# EAGLE schematic PDNode-600 Pro (EAGLE 9.2.1), part 1 of 2

## Sheet 1 of 12
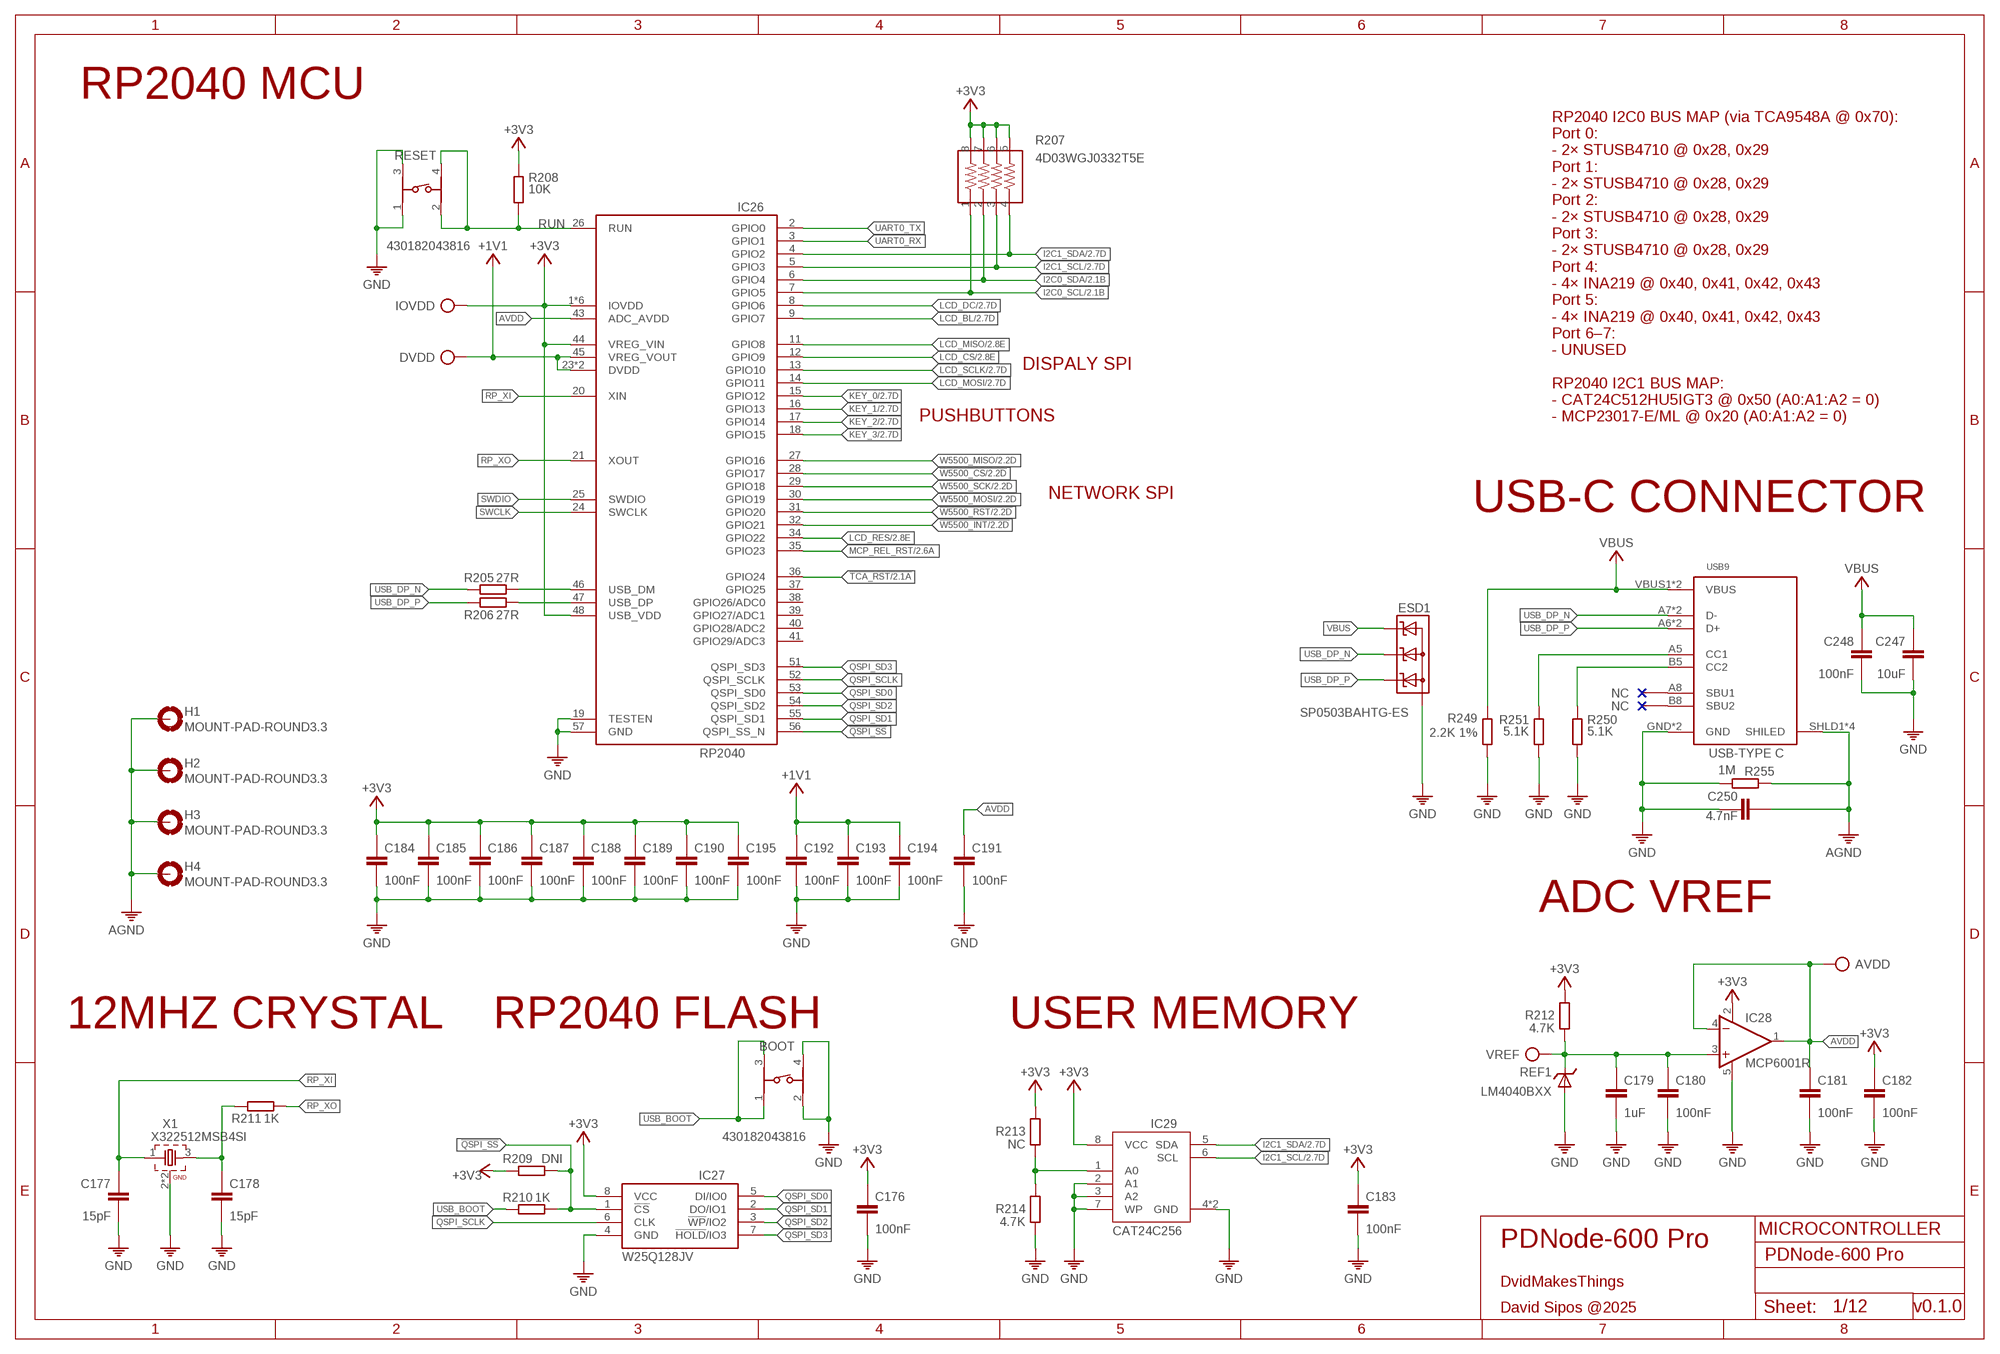
[diagram p0: schematic, sheet 1]

### Parts
AVDD  TP  [TP]
BOOT  430182043816  430182050816  [430182050816]
C176  100nF  C-0201  [0201]
C177  15pF  C-0201  [0201]
C178  15pF  C-0201  [0201]
C179  1uF  C-0402  [C0402]
C180  100nF  C-0201  [0201]
C181  100nF  C-0201  [0201]
C182  100nF  C-0201  [0201]
C183  100nF  C-0201  [0201]
C184  100nF  C-0201  [0201]
C185  100nF  C-0201  [0201]
C186  100nF  C-0201  [0201]
C187  100nF  C-0201  [0201]
C188  100nF  C-0201  [0201]
C189  100nF  C-0201  [0201]
C190  100nF  C-0201  [0201]
C191  100nF  C-0201  [0201]
C192  100nF  C-0201  [0201]
C193  100nF  C-0201  [0201]
C194  100nF  C-0201  [0201]
C195  100nF  C-0201  [0201]
C247  10uF  C0805  [0805]
C248  100nF  C0402  [0402]
C250  4.7nF  C-0402  [C0402]
DVDD  TP  [TP]
ESD1  SP0503BAHTG-ES  SP0503BAHT  [SOT143]
H1  MOUNT-PAD-ROUND3.3  [3,3-PAD]
H2  MOUNT-PAD-ROUND3.3  [3,3-PAD]
H3  MOUNT-PAD-ROUND3.3  [3,3-PAD]
H4  MOUNT-PAD-ROUND3.3  [3,3-PAD]
IC26  RP2040  [QFN40P700X700X100-57T510]
IC27  W25Q128JVPIQ  W25Q128JVP  [SON127P600X500X75-8N]
IC28  MCP6001R  MCP6001RT  [SOT23-5]
IC29  CAT24C512HU5IGT3  CAT24C256-HU4  [SON50P300X200X50-9T130X140N]
IOVDD  TP  [TP]
R205  27R  R0201  [R0201]
R206  27R  R0201  [R0201]
R207  4D03WGJ0332T5E  742C083103JP  [742C083103JP]
R208  10K  R0201  [R0201]
R209  DNI  R0201  [R0201]
R210  1K  R0201  [R0201]
R211  1K  R0201  [R0201]
R212  4.7K  R0402  [0402]
R213  NC  R0201  [R0201]
R214  4.7K  R0201  [R0201]
R249  2.2K 1%  R0201  [R0201]
R250  5.1K  R0201  [R0201]
R251  5.1K  R0201  [R0201]
R255  1M  R0402  [0402]
REF1  LM4040BXX  [SOT23]
RESET  430182043816  430182050816  [430182050816]
USB9  USB_C-THT  [USB-C]
VREF  TP  [TP]
X1  X322512MSB4SI  WE-XTAL_CFPX-180_830055295  [WE-XTAL_CFPX-180]

### Nets
!QSPI_SS: IC26.56(QSPI_SS_N) IC27.1(!CS) R209.1 R210.2
!TCA_RST: IC26.36(GPIO24) ; also sheet 2
!W5500_CS: IC26.28(GPIO17) ; also sheet 2
!W5500_INT: IC26.32(GPIO21) ; also sheet 2
!W5500_RST: IC26.31(GPIO20) ; also sheet 2
+1V1: C192.1 C193.1 C194.1 DVDD.TP IC26.23(DVDD) IC26.45(VREG_VOUT) IC26.50(DVDD)
+3V3: C176.1 C182.1 C183.1 C184.1 C185.1 C186.1 C187.1 C188.1 C189.1 C190.1 C195.1 IC26.1(IOVDD) IC26.10(IOVDD) IC26.22(IOVDD) IC26.33(IOVDD) IC26.42(IOVDD) IC26.44(VREG_VIN) IC26.48(USB_VDD) IC26.49(IOVDD) IC27.8(VCC) IC28.2(V+) IC29.8(VCC) IOVDD.TP R207.5 R207.6 R207.7 R207.8 R208.1 R209.2 R212.2 R213.2 ; also sheet 2,3,4,5,6,7,8,9,10,11,12
AGND: C250.1 H1.B3,3(MOUNT) H2.B3,3(MOUNT) H3.B3,3(MOUNT) H4.B3,3(MOUNT) R255.1 USB9.SHLD1(SHILED) USB9.SHLD2(SHILED) USB9.SHLD3(SHILED) USB9.SHLD4(SHILED) ; also sheet 2,4,5,6,7,8,9,10,11,12
AVDD: AVDD.TP C181.1 C191.1 IC26.43(ADC_AVDD) IC28.1(OUT) IC28.4(-IN)
CC1: R251.1 USB9.A5(CC1)
CC2: R250.1 USB9.B5(CC2)
GND: BOOT.2 BOOT.4 C176.2 C177.2 C178.2 C179.2 C180.2 C181.2 C182.2 C183.2 C184.2 C185.2 C186.2 C187.2 C188.2 C189.2 C190.2 C191.2 C192.2 C193.2 C194.2 C195.2 C247.2 C248.2 C250.2 ESD1.1(A) IC26.19(TESTEN) IC26.57(GND) IC27.4(GND) IC28.5(V-) IC29.2(A1) IC29.3(A2) IC29.4(GND) IC29.7(WP) IC29.9(GND) R214.1 R249.2 R250.2 R251.2 R255.2 REF1.2(A) REF1.3(A) RESET.1 RESET.3 USB9.GND USB9.GND2(GND) X1.2(GND) X1.4(GND) ; also sheet 2,3,4,5,6,7,8,9,10,11,12
I2C0_SCL: IC26.7(GPIO5) R207.1 ; also sheet 2
I2C0_SDA: IC26.6(GPIO4) R207.2 ; also sheet 2
I2C1_SCL: IC26.5(GPIO3) IC29.6(SCL) R207.3 ; also sheet 2
I2C1_SDA: IC26.4(GPIO2) IC29.5(SDA) R207.4 ; also sheet 2
KEY_0: IC26.15(GPIO12) ; also sheet 2
KEY_1: IC26.16(GPIO13) ; also sheet 2
KEY_2: IC26.17(GPIO14) ; also sheet 2
KEY_3: IC26.18(GPIO15) ; also sheet 2
LCD_BL: IC26.9(GPIO7) ; also sheet 2
LCD_CS: IC26.12(GPIO9) ; also sheet 2
LCD_DC: IC26.8(GPIO6) ; also sheet 2
LCD_MISO: IC26.11(GPIO8) ; also sheet 2
LCD_MOSI: IC26.14(GPIO11) ; also sheet 2
LCD_RES: IC26.34(GPIO22) ; also sheet 2
LCD_SCLK: IC26.13(GPIO10) ; also sheet 2
MCP_REL_RST: IC26.35(GPIO23) ; also sheet 2
MCU_DP_N [90R_DIFFPAIR]: IC26.46(USB_DM) R205.2
MCU_DP_P [90R_DIFFPAIR]: IC26.47(USB_DP) R206.2
N$43: C178.1 R211.1 X1.3
N$222: IC29.1(A0) R213.1 R214.2
QSPI_SCLK: IC26.52(QSPI_SCLK) IC27.6(CLK)
QSPI_SD0: IC26.53(QSPI_SD0) IC27.5(DI/IO0)
QSPI_SD1: IC26.55(QSPI_SD1) IC27.2(DO/IO1)
QSPI_SD2: IC26.54(QSPI_SD2) IC27.3(!WP!/IO2)
QSPI_SD3: IC26.51(QSPI_SD3) IC27.7(!HOLD!/IO3)
RP_XI: C177.1 IC26.20(XIN) X1.1
RP_XO: IC26.21(XOUT) R211.2
RUN: IC26.26(RUN) R208.2 RESET.2 RESET.4
SWCLK: IC26.24(SWCLK)
SWDIO: IC26.25(SWDIO)
UART0_RX: IC26.3(GPIO1)
UART0_TX: IC26.2(GPIO0)
USB_BOOT: BOOT.1 BOOT.3 R210.1
USB_DP_N [90R_DIFFPAIR]: ESD1.3(C2) R205.1 USB9.A7(D-) USB9.B7(D-)
USB_DP_P [90R_DIFFPAIR]: ESD1.2(C1) R206.1 USB9.A6(D+) USB9.B6(D+)
VBUS: C247.1 C248.1 ESD1.4(C3) R249.1 USB9.VBUS1(VBUS) USB9.VBUS2(VBUS)
VREF: C179.1 C180.1 IC28.3(+IN) R212.1 REF1.1(C) VREF.TP
W5500_MISO: IC26.27(GPIO16) ; also sheet 2
W5500_MOSI: IC26.30(GPIO19) ; also sheet 2
W5500_SCK: IC26.29(GPIO18) ; also sheet 2
Unconnected: IC26.37(GPIO25) IC26.38(GPIO26/ADC0) IC26.39(GPIO27/ADC1) IC26.40(GPIO28/ADC2) IC26.41(GPIO29/ADC3) USB9.A8(SBU1) USB9.B8(SBU2)

### Notes on the sheet
- RP2040 MCU
- DISPALY SPI
- PUSHBUTTONS
- RP2040 I2C0 BUS MAP (via TCA9548A @ 0x70):
  Port 0:
  - 2× STUSB4710 @ 0x28, 0x29
  Port 1:
  - 2× STUSB4710 @ 0x28, 0x29
  Port 2:
  - 2× STUSB4710 @ 0x28, 0x29
  Port 3:
  - 2× STUSB4710 @ 0x28, 0x29
  Port 4:
  - 4× INA219 @ 0x40, 0x41, 0x42, 0x43
  Port 5:
  - 4× INA219 @ 0x40, 0x41, 0x42, 0x43
  Port 6–7:
  - UNUSED
  
  RP2040 I2C1 BUS MAP:
  - CAT24C512HU5IGT3 @ 0x50 (A0:A1:A2 = 0)
  - MCP23017-E/ML @ 0x20 (A0:A1:A2 = 0)
- NETWORK SPI
- USB-C CONNECTOR
- ADC VREF
- 12MHZ CRYSTAL | RP2040 FLASH | USER MEMORY
- MICROCONTROLLER
- PDNode-600 Pro
- DvidMakesThings
- David Sipos @2025 | v0.1.0

## Sheet 2 of 12
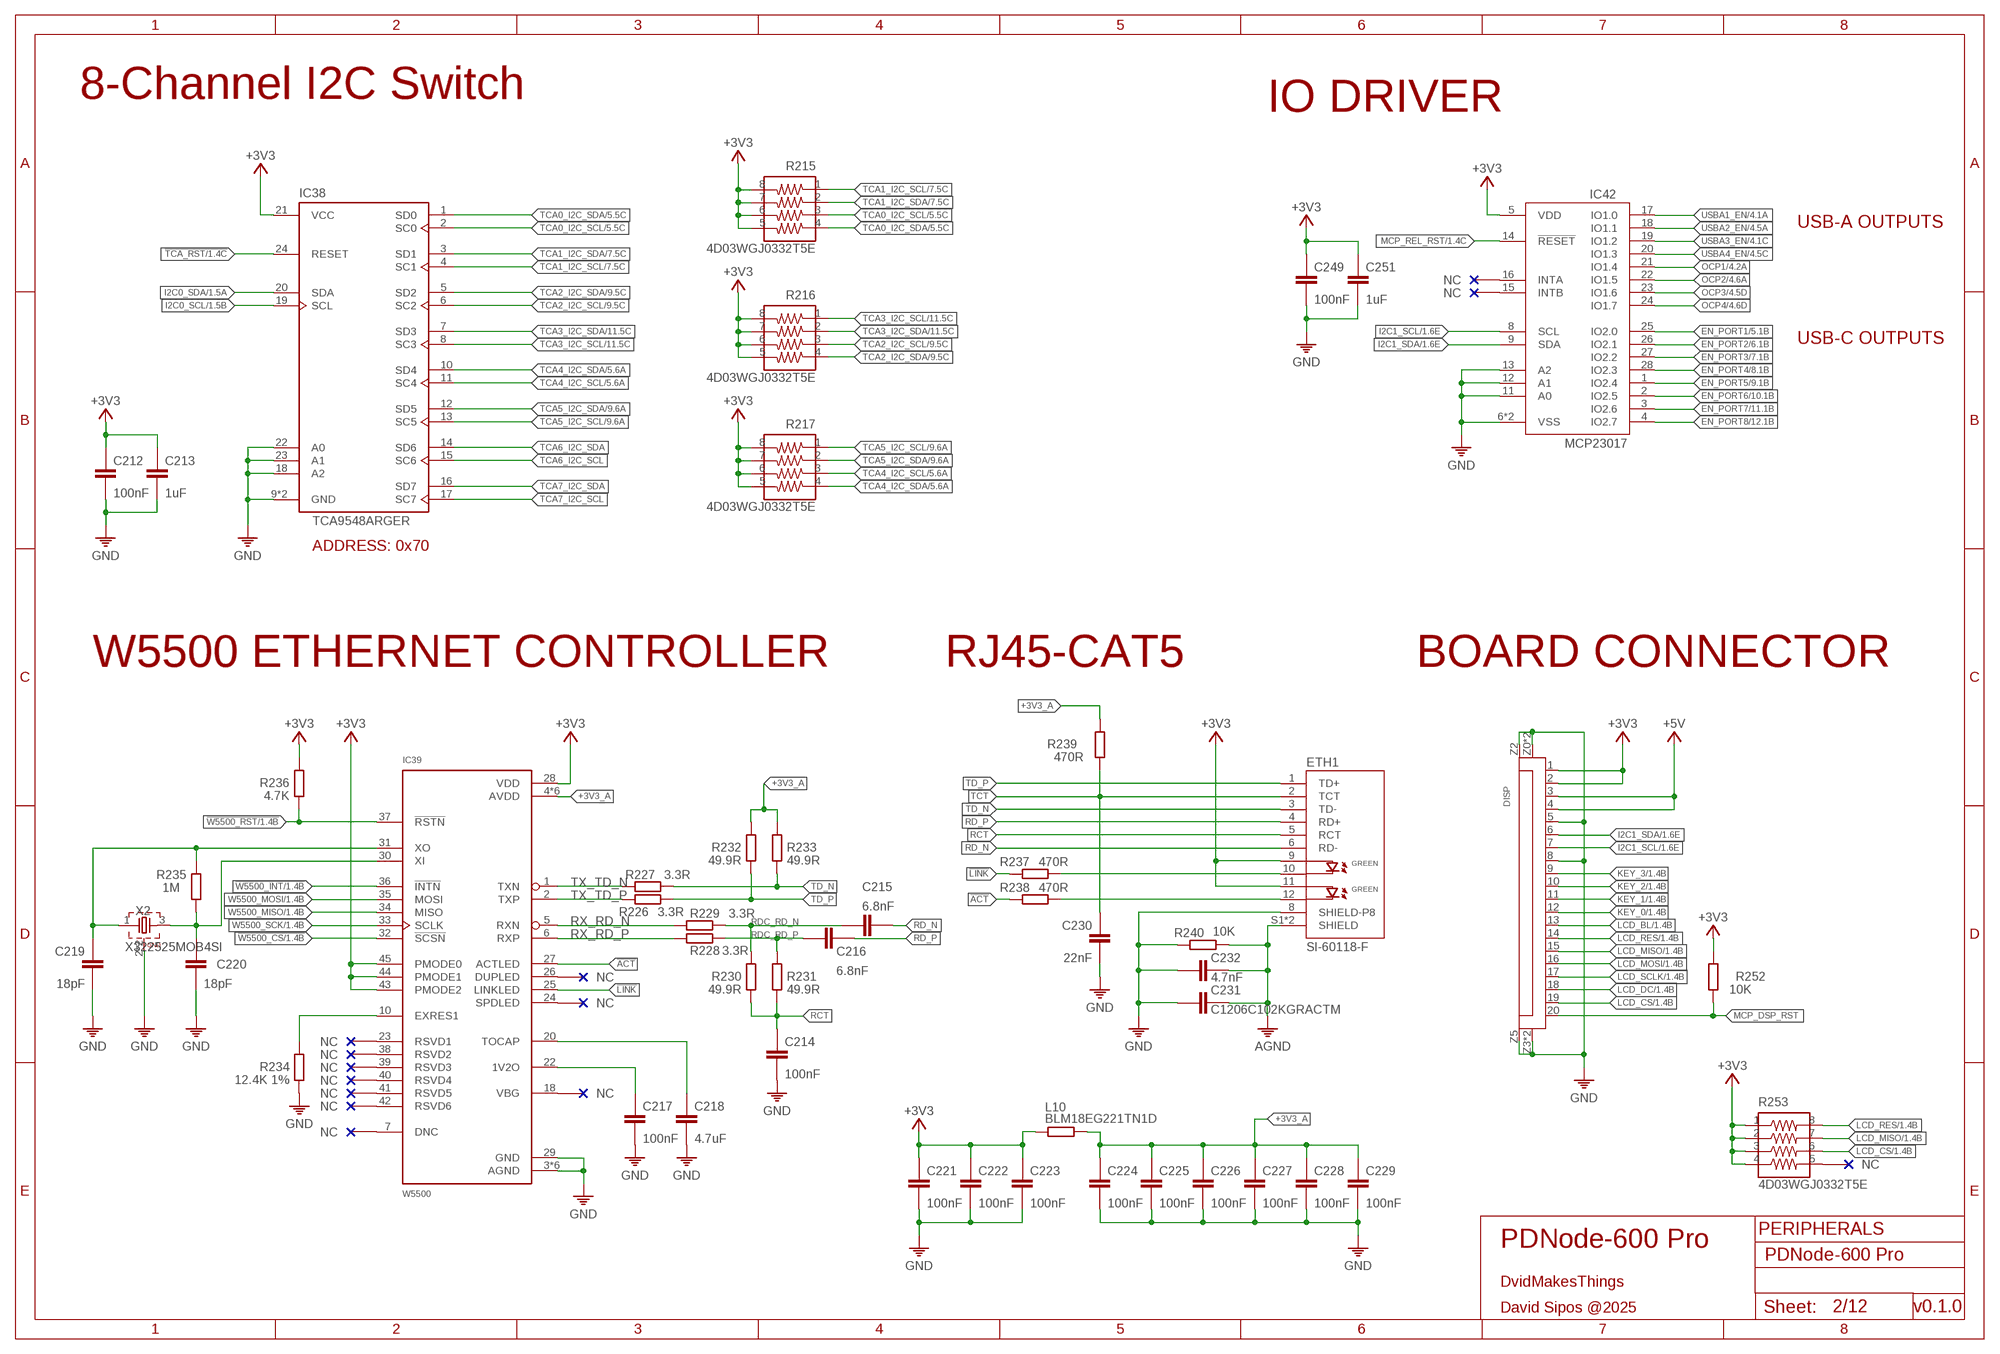
[diagram p1: schematic, sheet 2]

### Parts
C212  100nF  C-0201  [0201]
C213  1uF  C-0201  [0201]
C214  100nF  C-0201  [0201]
C215  6.8nF  C-0201  [0201]
C216  6.8nF  C-0201  [0201]
C217  100nF  C-0201  [0201]
C218  4.7uF  C-0402  [C0402]
C219  18pF  C-0201  [0201]
C220  18pF  C-0201  [0201]
C221  100nF  C-0201  [0201]
C222  100nF  C-0201  [0201]
C223  100nF  C-0201  [0201]
C224  100nF  C-0201  [0201]
C225  100nF  C-0201  [0201]
C226  100nF  C-0201  [0201]
C227  100nF  C-0201  [0201]
C228  100nF  C-0201  [0201]
C229  100nF  C-0201  [0201]
C230  22nF  C-0402  [C0402]
C231  C1206C102KGRACTM  C-1206  [C1206]
C232  4.7nF  C-0402  [C0402]
C249  100nF  C-0201  [0201]
C251  1uF  C-0201  [0201]
DISP  AFC11-S20ICC-00  [FPC20]
ETH1  SI-60118-F  RJ45-CAT5  [RJ45-CAT5]
IC38  TCA9548ARGER  [QFN50P400X400X100-25T210N]
IC39  W5500  [LQFP48]
IC42  MCP23017-E/ML  [QFN28[6X6]ML]
L10  BLM18EG221TN1D  R0603  [0603]
R215  4D03WGJ0332T5E  YC164-JR-0733RL  [YC164-JR-0733RL]
R216  4D03WGJ0332T5E  YC164-JR-0733RL  [YC164-JR-0733RL]
R217  4D03WGJ0332T5E  YC164-JR-0733RL  [YC164-JR-0733RL]
R226  3.3R  R0201  [R0201]
R227  3.3R  R0201  [R0201]
R228  3.3R  R0201  [R0201]
R229  3.3R  R0201  [R0201]
R230  49.9R  R0201  [R0201]
R231  49.9R  R0201  [R0201]
R232  49.9R  R0201  [R0201]
R233  49.9R  R0201  [R0201]
R234  12.4K 1%  R0201  [R0201]
R235  1M  R0201  [R0201]
R236  4.7K  R0201  [R0201]
R237  470R  R0402  [0402]
R238  470R  R0402  [0402]
R239  470R  R0402  [0402]
R240  10K  R0402  [0402]
R252  10K  R0402  [0402]
R253  4D03WGJ0332T5E  742C083103JP  [742C083103JP]
X2  X322525MOB4SI  WE-XTAL_CFPX-180_830035268  [WE-XTAL_CFPX-180]

### Nets
!ACT: IC39.27(ACTLED) R238.1
!LINK: IC39.25(LINKLED) R237.1
!TCA_RST: IC38.24(RESET) ; also sheet 1
!W5500_CS: IC39.32(!SCSN) ; also sheet 1
!W5500_INT: IC39.36(!INTN) ; also sheet 1
!W5500_RST: IC39.37(!RSTN) R236.1 ; also sheet 1
+3V3: C212.1 C213.1 C221.1 C222.1 C223.1 C249.1 C251.1 DISP.1 DISP.2 ETH1.9(GA1) ETH1.11(GA2) IC38.21(VCC) IC39.28(VDD) IC39.43(PMODE2) IC39.44(PMODE1) IC39.45(PMODE0) IC42.5(VDD) L10.1 R215.5 R215.6 R215.7 R215.8 R216.5 R216.6 R216.7 R216.8 R217.5 R217.6 R217.7 R217.8 R236.2 R252.2 R253.1 R253.2 R253.3 R253.4 ; also sheet 1,3,4,5,6,7,8,9,10,11,12
+3V3_A: C224.1 C225.1 C226.1 C227.1 C228.1 C229.1 IC39.4(AVDD) IC39.8(AVDD) IC39.11(AVDD) IC39.15(AVDD) IC39.17(AVDD) IC39.21(AVDD) L10.2 R232.2 R233.2 R239.2
+5V: DISP.3 DISP.4
AGND: C231.2 C232.2 ETH1.S1(SHIELD) ETH1.S2(SHIELD) R240.2 ; also sheet 1,4,5,6,7,8,9,10,11,12
EN_PORT1: IC42.25(IO2.0) ; also sheet 5
EN_PORT2: IC42.26(IO2.1) ; also sheet 6
EN_PORT3: IC42.27(IO2.2) ; also sheet 7
EN_PORT4: IC42.28(IO2.3) ; also sheet 8
EN_PORT5: IC42.1(IO2.4) ; also sheet 9
EN_PORT6: IC42.2(IO2.5) ; also sheet 10
EN_PORT7: IC42.3(IO2.6) ; also sheet 11
EN_PORT8: IC42.4(IO2.7) ; also sheet 12
GND: C212.2 C213.2 C214.2 C217.2 C218.2 C219.2 C220.2 C221.2 C222.2 C223.2 C224.2 C225.2 C226.2 C227.2 C228.2 C229.2 C230.2 C231.1 C232.1 C249.2 C251.2 DISP.5 DISP.8 DISP.Z0(Z1) DISP.Z1 DISP.Z2 DISP.Z3 DISP.Z4(Z3) DISP.Z5(Z4) ETH1.8(SHIELD-P8) IC38.9(GND) IC38.18(A2) IC38.22(A0) IC38.23(A1) IC38.25(GND) IC39.3(AGND) IC39.9(AGND) IC39.14(AGND) IC39.16(AGND) IC39.19(AGND) IC39.29(GND) IC39.48(AGND) IC42.6(VSS) IC42.11(A0) IC42.12(A1) IC42.13(A2) IC42.PAD(VSS) R234.1 R240.1 X2.2(GND) X2.4(GND) ; also sheet 1,3,4,5,6,7,8,9,10,11,12
I2C0_SCL: IC38.19(SCL) ; also sheet 1
I2C0_SDA: IC38.20(SDA) ; also sheet 1
I2C1_SCL: DISP.7 IC42.8(SCL) ; also sheet 1
I2C1_SDA: DISP.6 IC42.9(SDA) ; also sheet 1
KEY_0: DISP.12 ; also sheet 1
KEY_1: DISP.11 ; also sheet 1
KEY_2: DISP.10 ; also sheet 1
KEY_3: DISP.9 ; also sheet 1
LCD_BL: DISP.13 ; also sheet 1
LCD_CS: DISP.19 R253.6 ; also sheet 1
LCD_DC: DISP.18 ; also sheet 1
LCD_MISO: DISP.15 R253.7 ; also sheet 1
LCD_MOSI: DISP.16 ; also sheet 1
LCD_RES: DISP.14 R253.8 ; also sheet 1
LCD_SCLK: DISP.17 ; also sheet 1
MCP_DSP_RST: DISP.20 R252.1
MCP_REL_RST: IC42.14(!RESET) ; also sheet 1
N$252: IC39.10(EXRES1) R234.2
N$257: C217.1 IC39.22(1V2O)
N$258: C218.1 IC39.20(TOCAP)
N$259: C220.1 IC39.30(XI) R235.1 X2.3
N$260: ETH1.10(GK1) R237.2
N$261: ETH1.12(GK2) R238.2
OCP1: IC42.21(IO1.4) ; also sheet 4
OCP2: IC42.22(IO1.5) ; also sheet 4
OCP3: IC42.23(IO1.6) ; also sheet 4
OCP4: IC42.24(IO1.7) ; also sheet 4
RCT: C214.1 ETH1.5(RCT) R230.1 R231.1
RD_N [100R_DIFFPAIR]: C215.2 ETH1.6(RD-)
RD_P [100R_DIFFPAIR]: C216.2 ETH1.4(RD+)
RDC_RD_N [100R_DIFFPAIR]: C215.1 R229.2 R230.2
RDC_RD_P [100R_DIFFPAIR]: C216.1 R228.2 R231.2
RX_RD_N [100R_DIFFPAIR]: IC39.5(RXN) R229.1
RX_RD_P [100R_DIFFPAIR]: IC39.6(RXP) R228.1
TCA0_I2C_SCL: IC38.2(SC0) R215.3 ; also sheet 5,6
TCA0_I2C_SDA: IC38.1(SD0) R215.4 ; also sheet 5,6
TCA1_I2C_SCL: IC38.4(SC1) R215.1 ; also sheet 7,8
TCA1_I2C_SDA: IC38.3(SD1) R215.2 ; also sheet 7,8
TCA2_I2C_SCL: IC38.6(SC2) R216.3 ; also sheet 9,10
TCA2_I2C_SDA: IC38.5(SD2) R216.4 ; also sheet 9,10
TCA3_I2C_SCL: IC38.8(SC3) R216.1 ; also sheet 11,12
TCA3_I2C_SDA: IC38.7(SD3) R216.2 ; also sheet 11,12
TCA4_I2C_SCL: IC38.11(SC4) R217.3 ; also sheet 5,6,7,8
TCA4_I2C_SDA: IC38.10(SD4) R217.4 ; also sheet 5,6,7,8
TCA5_I2C_SCL: IC38.13(SC5) R217.1 ; also sheet 9,10,11,12
TCA5_I2C_SDA: IC38.12(SD5) R217.2 ; also sheet 9,10,11,12
TCA6_I2C_SCL: IC38.15(SC6)
TCA6_I2C_SDA: IC38.14(SD6)
TCA7_I2C_SCL: IC38.17(SC7)
TCA7_I2C_SDA: IC38.16(SD7)
TCT: C230.1 ETH1.2(TCT) R239.1
TD_N [100R_DIFFPAIR]: ETH1.3(TD-) R227.2 R233.1
TD_P [100R_DIFFPAIR]: ETH1.1(TD+) R226.2 R232.1
TX_TD_N [100R_DIFFPAIR]: IC39.1(TXN) R227.1
TX_TD_P [100R_DIFFPAIR]: IC39.2(TXP) R226.1
USBA1_EN: IC42.17(IO1.0) ; also sheet 4
USBA2_EN: IC42.18(IO1.1) ; also sheet 4
USBA3_EN: IC42.19(IO1.2) ; also sheet 4
USBA4_EN: IC42.20(IO1.3) ; also sheet 4
W5500_MISO: IC39.34(MISO) ; also sheet 1
W5500_MOSI: IC39.35(MOSI) ; also sheet 1
W5500_SCK: IC39.33(SCLK) ; also sheet 1
XO: C219.1 IC39.31(XO) R235.2 X2.1
Unconnected: IC39.7(DNC) IC39.18(VBG) IC39.23(RSVD1) IC39.24(SPDLED) IC39.26(DUPLED) IC39.38(RSVD2) IC39.39(RSVD3) IC39.40(RSVD4) IC39.41(RSVD5) IC39.42(RSVD6) IC42.15(INTB) IC42.16(INTA) R253.5

### Notes on the sheet
- 8-Channel I2C Switch | IO DRIVER
- USB-A OUTPUTS
- USB-C OUTPUTS
- ADDRESS: 0x70
- W5500 ETHERNET CONTROLLER | RJ45-CAT5 | BOARD CONNECTOR
- PERIPHERALS
- PDNode-600 Pro
- DvidMakesThings
- David Sipos @2025 | v0.1.0

## Sheet 3 of 12: POWER
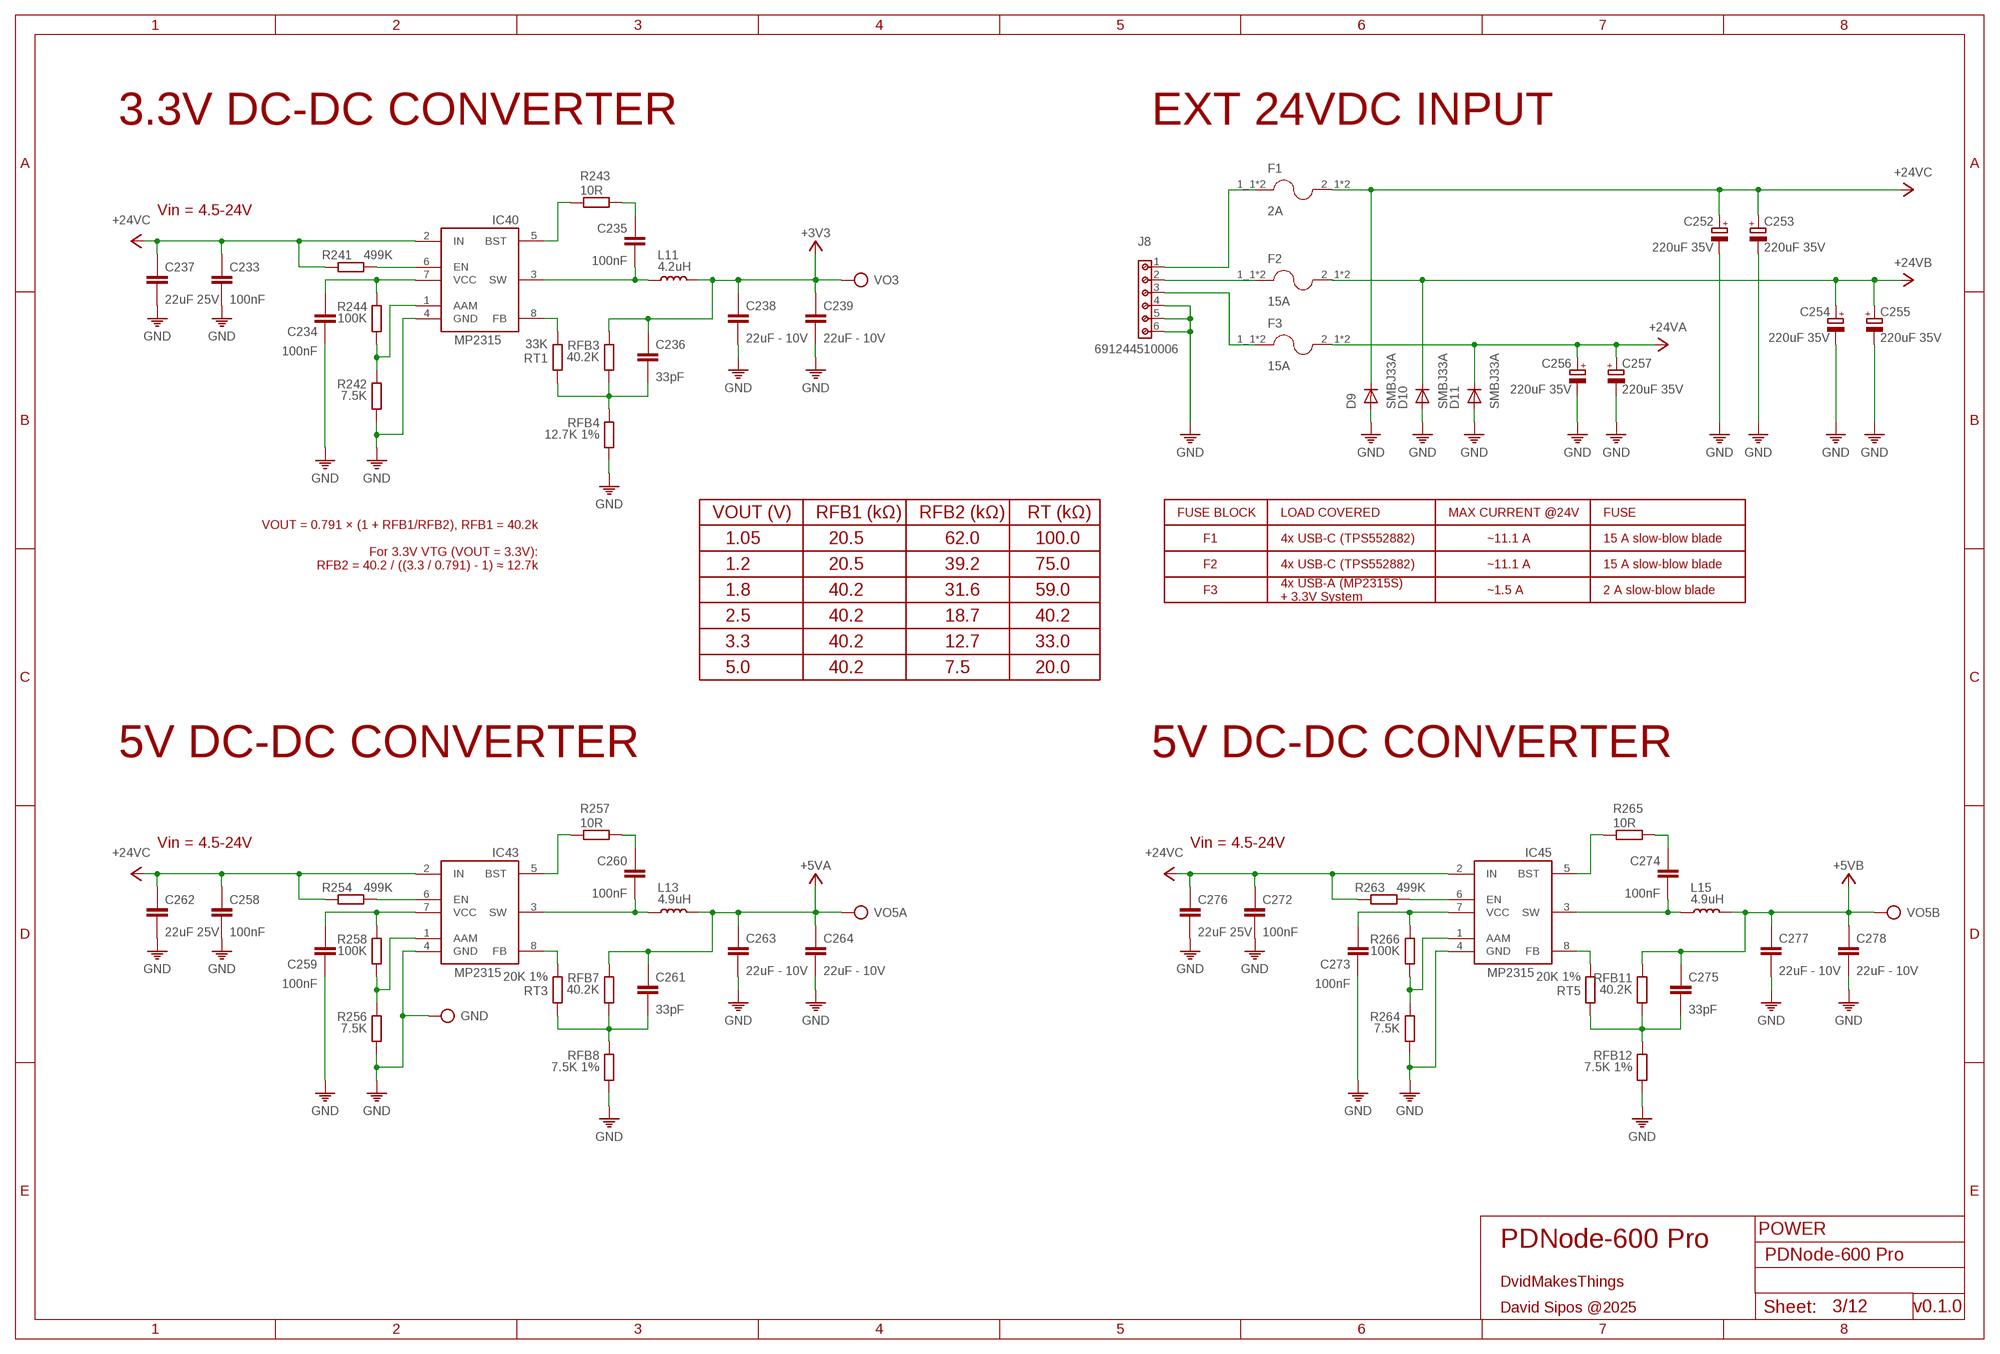
[diagram p2: schematic, sheet 3]

### Parts
C233  100nF  C-0201  [0201]
C234  100nF  C-0201  [0201]
C235  100nF  C-0201  [0201]
C236  33pF  C-0201  [0201]
C237  22uF 25V  C-1206  [C1206]
C238  22uF - 10V  C-1206  [C1206]
C239  22uF - 10V  C-1206  [C1206]
C252  220uF 35V  C-POL_ECAP-8.5MM  [CAPAE830X1050N]
C253  220uF 35V  C-POL_ECAP-8.5MM  [CAPAE830X1050N]
C254  220uF 35V  C-POL_ECAP-8.5MM  [CAPAE830X1050N]
C255  220uF 35V  C-POL_ECAP-8.5MM  [CAPAE830X1050N]
C256  220uF 35V  C-POL_ECAP-8.5MM  [CAPAE830X1050N]
C257  220uF 35V  C-POL_ECAP-8.5MM  [CAPAE830X1050N]
C258  100nF  C-0201  [0201]
C259  100nF  C-0201  [0201]
C260  100nF  C-0201  [0201]
C261  33pF  C-0201  [0201]
C262  22uF 25V  C-1206  [C1206]
C263  22uF - 10V  C-1206  [C1206]
C264  22uF - 10V  C-1206  [C1206]
C272  100nF  C-0201  [0201]
C273  100nF  C-0201  [0201]
C274  100nF  C-0201  [0201]
C275  33pF  C-0201  [0201]
C276  22uF 25V  C-1206  [C1206]
C277  22uF - 10V  C-1206  [C1206]
C278  22uF - 10V  C-1206  [C1206]
D9  SMBJ33A  DIODE-SMB  [SMB]
D10  SMBJ33A  DIODE-SMB  [SMB]
D11  SMBJ33A  DIODE-SMB  [SMB]
F1  2A  BLADE-FUSE  [FUSE_3544-2]
F2  15A  BLADE-FUSE  [FUSE_3544-2]
F3  15A  BLADE-FUSE  [FUSE_3544-2]
GND  TP  [TP]
IC40  MP2315S  MP2315TSOT23-8  [SOT65P280X110-8N]
IC43  MP2315S  MP2315TSOT23-8  [SOT65P280X110-8N]
IC45  MP2315S  MP2315TSOT23-8  [SOT65P280X110-8N]
J8  691244510006  [691244510006]
L11  4.2uH  L  [SRR5228A]
L13  4.9uH  L  [SRR5228A]
L15  4.9uH  L  [SRR5228A]
R241  499K  R0201  [R0201]
R242  7.5K  R0201  [R0201]
R243  10R  R0201  [R0201]
R244  100K  R0201  [R0201]
R254  499K  R0201  [R0201]
R256  7.5K  R0201  [R0201]
R257  10R  R0201  [R0201]
R258  100K  R0201  [R0201]
R263  499K  R0201  [R0201]
R264  7.5K  R0201  [R0201]
R265  10R  R0201  [R0201]
R266  100K  R0201  [R0201]
RFB3  40.2K  R0201  [R0201]
RFB4  12.7K 1%  R0201  [R0201]
RFB7  40.2K  R0201  [R0201]
RFB8  7.5K 1%  R0201  [R0201]
RFB11  40.2K  R0201  [R0201]
RFB12  7.5K 1%  R0201  [R0201]
RT1  33K  R0201  [R0201]
RT3  20K 1%  R0201  [R0201]
RT5  20K 1%  R0201  [R0201]
VO3  TP  [TP]
VO5A  TP  [TP]
VO5B  TP  [TP]

### Nets
3V3_EN_SYS1: IC40.6(EN) R241.2
3V3_EN_SYS3: IC43.6(EN) R254.2
3V3_EN_SYS5: IC45.6(EN) R263.2
24VINA: F2.1_1 F2.1_2 J8.2
24VINB: F3.1_1 F3.1_2 J8.3
24VINC: F1.1_1 F1.1_2 J8.1
+3V3: C236.1 C238.1 C239.1 L11.2 RFB3.1 VO3.TP ; also sheet 1,2,4,5,6,7,8,9,10,11,12
+5VA: C261.1 C263.1 C264.1 L13.2 RFB7.1 VO5A.TP ; also sheet 4
+5VB: C275.1 C277.1 C278.1 L15.2 RFB11.1 VO5B.TP ; also sheet 4
+24V_A: C256.1(+) C257.1(+) D11.C F3.2_1 F3.2_2 ; supply symbol labelled +24VA ; also sheet 5,6,7,8
+24V_B: C254.1(+) C255.1(+) D10.C F2.2_1 F2.2_2 ; supply symbol labelled +24VB ; also sheet 9,10,11,12
+24V_C: C233.1 C237.1 C252.1(+) C253.1(+) C258.1 C262.1 C272.1 C276.1 D9.C F1.2_1 F1.2_2 IC40.2(IN) IC43.2(IN) IC45.2(IN) R241.1 R254.1 R263.1 ; supply symbol labelled +24VC
GND: C233.2 C234.2 C237.2 C238.2 C239.2 C252.2(-) C253.2(-) C254.2(-) C255.2(-) C256.2(-) C257.2(-) C258.2 C259.2 C262.2 C263.2 C264.2 C272.2 C273.2 C276.2 C277.2 C278.2 D9.A D10.A D11.A GND.TP IC40.4(GND) IC43.4(GND) IC45.4(GND) J8.4 J8.5 J8.6 R242.2 R256.2 R264.2 RFB4.2 RFB8.2 RFB12.2 ; also sheet 1,2,4,5,6,7,8,9,10,11,12
N$267: IC40.5(BST) R243.2
N$268: IC40.8(FB) RT1.1
N$269: C235.2 IC40.3(SW) L11.1
N$270: C235.1 R243.1
N$271: C236.2 RFB3.2 RFB4.1 RT1.2
N$275: C234.1 IC40.7(VCC) R244.1
N$276: IC40.1(AAM) R242.1 R244.2
N$288: IC43.5(BST) R257.2
N$289: IC43.8(FB) RT3.1
N$290: C260.2 IC43.3(SW) L13.1
N$291: C260.1 R257.1
N$292: C261.2 RFB7.2 RFB8.1 RT3.2
N$293: C259.1 IC43.7(VCC) R258.1
N$294: IC43.1(AAM) R256.1 R258.2
N$306: IC45.5(BST) R265.2
N$307: IC45.8(FB) RT5.1
N$308: C274.2 IC45.3(SW) L15.1
N$309: C274.1 R265.1
N$310: C275.2 RFB11.2 RFB12.1 RT5.2
N$311: C273.1 IC45.7(VCC) R266.1
N$312: IC45.1(AAM) R264.1 R266.2

### Notes on the sheet
- 3.3V DC-DC CONVERTER | EXT 24VDC INPUT
- Vin = 4.5-24V
- VOUT (V) | RFB1 (kΩ) | RFB2 (kΩ) | RT (kΩ) | FUSE BLOCK | LOAD COVERED | MAX CURRENT @24V | FUSE
- 1.05 | 20.5 | 62.0 | 100.0 | F1 | 4x USB-C (TPS552882) | ~11.1 A | 15 A slow-blow blade
- 1.2 | 20.5 | 39.2 | 75.0 | F2 | 4x USB-C (TPS552882) | ~11.1 A | 15 A slow-blow blade
- VOUT = 0.791 × (1 + RFB1/RFB2), RFB1 = 40.2k
  
  For 3.3V VTG (VOUT = 3.3V):
     RFB2 = 40.2 / ((3.3 / 0.791) - 1) ≈ 12.7k
- 1.8 | 40.2 | 31.6 | 59.0 | F3
- 4x USB-A (MP2315S) 
  + 3.3V System
- ~1.5 A | 2 A slow-blow blade
- 2.5 | 40.2 | 18.7 | 40.2
- 3.3 | 40.2 | 12.7 | 33.0
- 5.0 | 40.2 | 7.5 | 20.0
- 5V DC-DC CONVERTER | 5V DC-DC CONVERTER
- Vin = 4.5-24V | Vin = 4.5-24V
- POWER
- PDNode-600 Pro
- DvidMakesThings
- David Sipos @2025 | v0.1.0

## Sheet 4 of 12: USB-A SOURCE PORT1-4
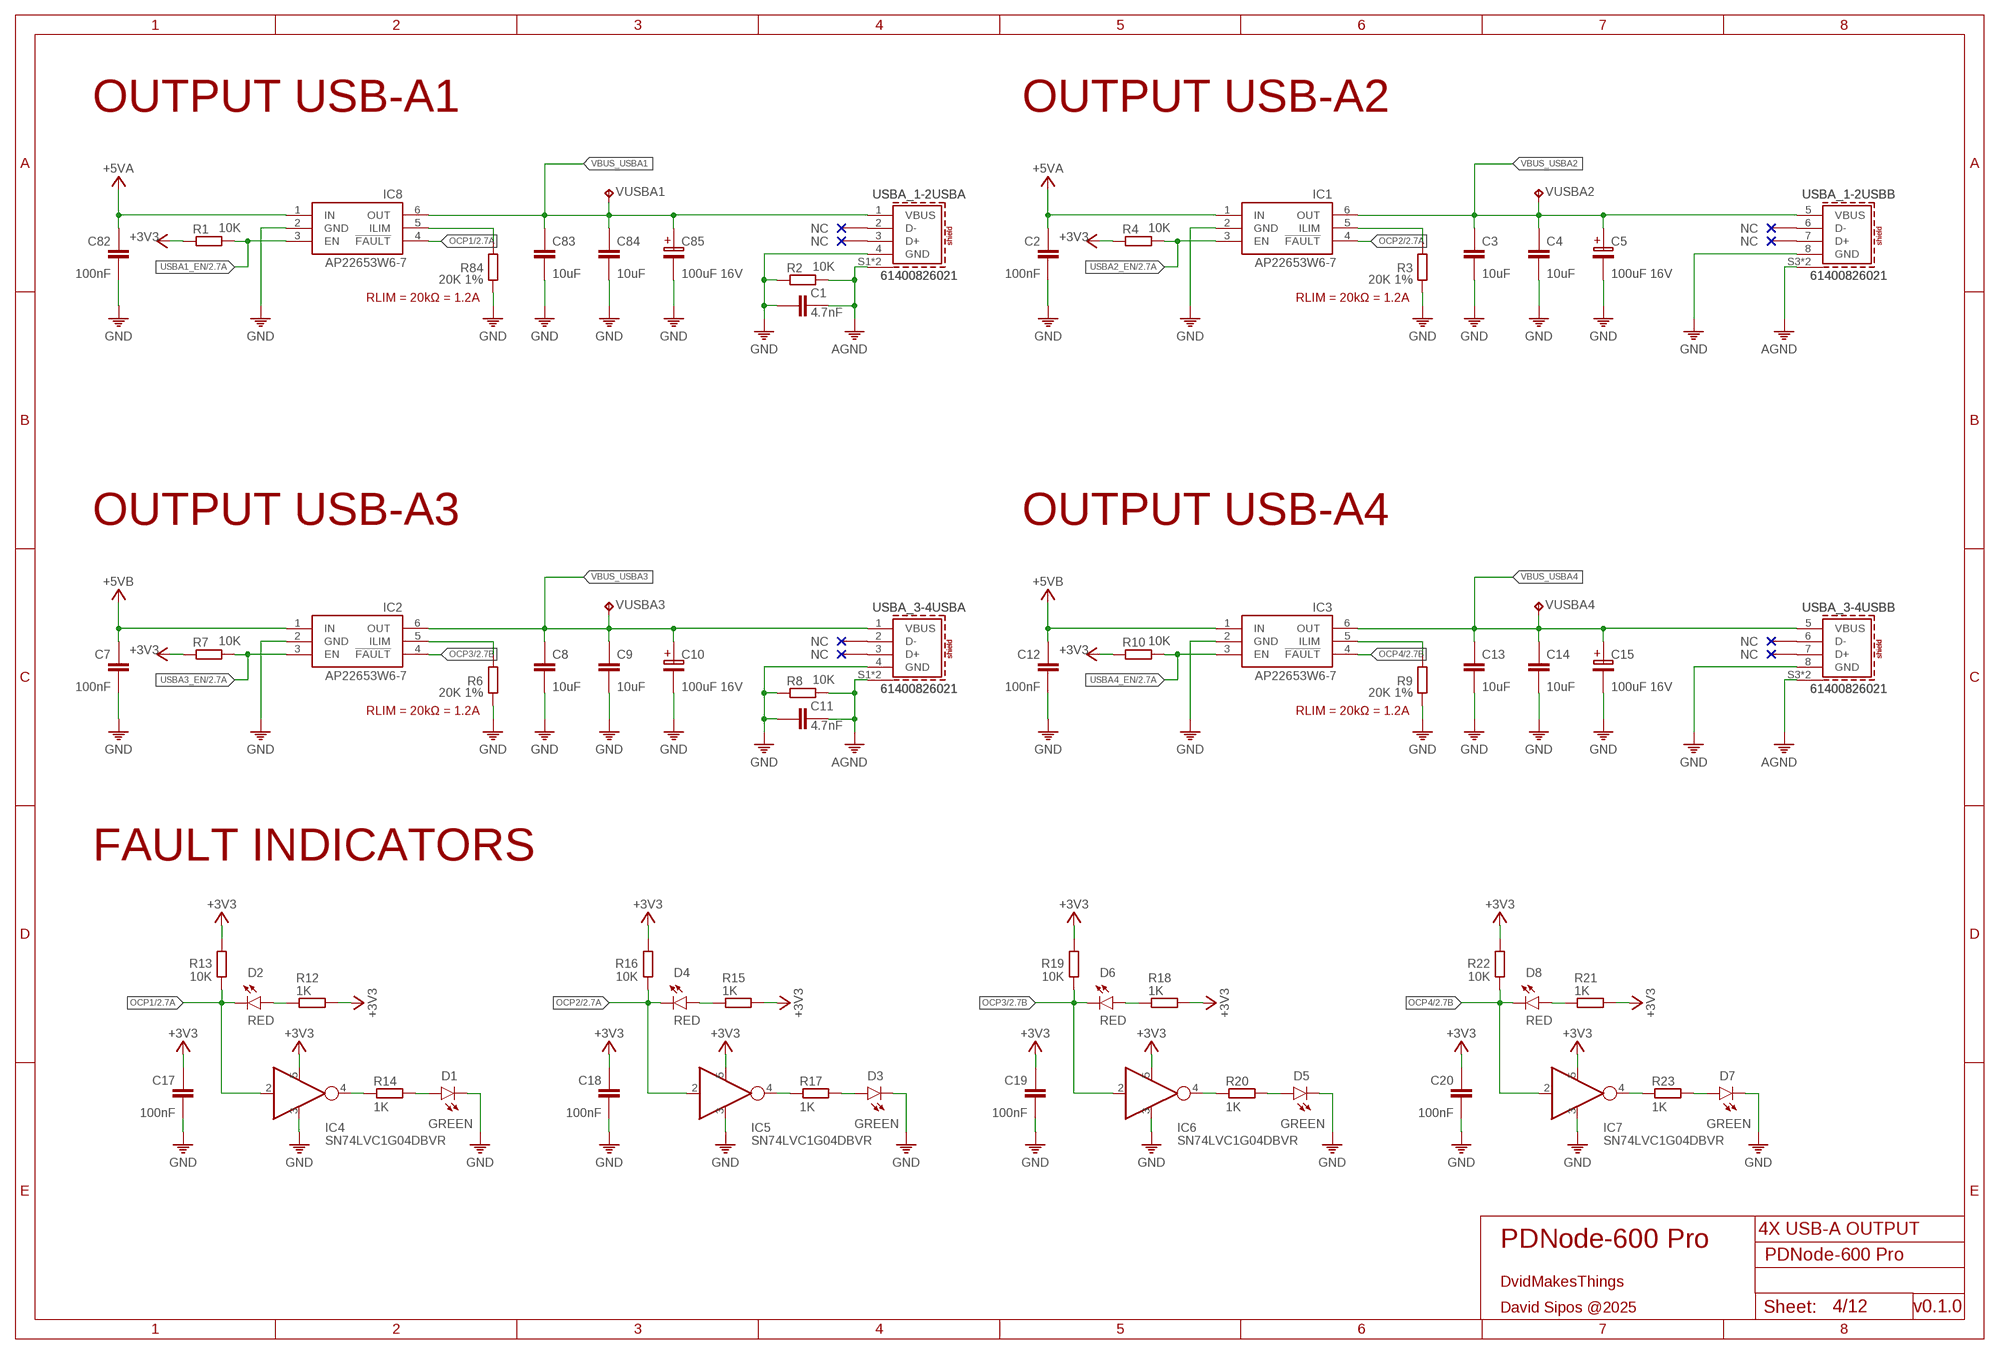
[diagram p3: schematic, sheet 4]

### Parts
C1  4.7nF  C-0402  [C0402]
C2  100nF  C-0402  [C0402]
C3  10uF  C-0805  [C0805]
C4  10uF  C-0805  [C0805]
C5  100uF 16V  CPOL  [100UF-16V]
C7  100nF  C-0402  [C0402]
C8  10uF  C-0805  [C0805]
C9  10uF  C-0805  [C0805]
C10  100uF 16V  CPOL  [100UF-16V]
C11  4.7nF  C-0402  [C0402]
C12  100nF  C-0402  [C0402]
C13  10uF  C-0805  [C0805]
C14  10uF  C-0805  [C0805]
C15  100uF 16V  CPOL  [100UF-16V]
C17  100nF  C-0402  [C0402]
C18  100nF  C-0402  [C0402]
C19  100nF  C-0402  [C0402]
C20  100nF  C-0402  [C0402]
C82  100nF  C-0402  [C0402]
C83  10uF  C-0805  [C0805]
C84  10uF  C-0805  [C0805]
C85  100uF 16V  CPOL  [100UF-16V]
D1  GREEN  CHIP-FLAT-G_0603-0.35MM  [LEDC1608X35N_FLAT-G]
D2  RED  CHIP-FLAT-R_0603-0.35MM  [LEDC1608X35N_FLAT-R]
D3  GREEN  CHIP-FLAT-G_0603-0.35MM  [LEDC1608X35N_FLAT-G]
D4  RED  CHIP-FLAT-R_0603-0.35MM  [LEDC1608X35N_FLAT-R]
D5  GREEN  CHIP-FLAT-G_0603-0.35MM  [LEDC1608X35N_FLAT-G]
D6  RED  CHIP-FLAT-R_0603-0.35MM  [LEDC1608X35N_FLAT-R]
D7  GREEN  CHIP-FLAT-G_0603-0.35MM  [LEDC1608X35N_FLAT-G]
D8  RED  CHIP-FLAT-R_0603-0.35MM  [LEDC1608X35N_FLAT-R]
IC1  AP22653W6-7  AP22653W6  [SOT23-6]
IC2  AP22653W6-7  AP22653W6  [SOT23-6]
IC3  AP22653W6-7  AP22653W6  [SOT23-6]
IC4  SN74LVC1G04DBVR  74LVC1G04  [SOT95P280X145-5N]
IC5  SN74LVC1G04DBVR  74LVC1G04  [SOT95P280X145-5N]
IC6  SN74LVC1G04DBVR  74LVC1G04  [SOT95P280X145-5N]
IC7  SN74LVC1G04DBVR  74LVC1G04  [SOT95P280X145-5N]
IC8  AP22653W6-7  AP22653W6  [SOT23-6]
R1  10K  R0402  [0402]
R2  10K  R0402  [0402]
R3  20K 1%  R0402  [0402]
R4  10K  R0402  [0402]
R6  20K 1%  R0402  [0402]
R7  10K  R0402  [0402]
R8  10K  R0402  [0402]
R9  20K 1%  R0402  [0402]
R10  10K  R0402  [0402]
R12  1K  R0402  [0402]
R13  10K  R0402  [0402]
R14  1K  R0402  [0402]
R15  1K  R0402  [0402]
R16  10K  R0402  [0402]
R17  1K  R0402  [0402]
R18  1K  R0402  [0402]
R19  10K  R0402  [0402]
R20  1K  R0402  [0402]
R21  1K  R0402  [0402]
R22  10K  R0402  [0402]
R23  1K  R0402  [0402]
R84  20K 1%  R0402  [0402]
USBA_1-2  61400826021  61400826021  [61400826021]
USBA_3-4  61400826021  61400826021  [61400826021]
VUSBA1  TPB1,27  [B1,27]
VUSBA2  TPB1,27  [B1,27]
VUSBA3  TPB1,27  [B1,27]
VUSBA4  TPB1,27  [B1,27]

### Nets
+3V3: C17.1 C18.1 C19.1 C20.1 IC4.5(V+) IC5.5(V+) IC6.5(V+) IC7.5(V+) R1.1 R4.1 R7.1 R10.1 R12.2 R13.2 R15.2 R16.2 R18.2 R19.2 R21.2 R22.2 ; also sheet 1,2,3,5,6,7,8,9,10,11,12
+5VA: C2.1 C82.1 IC1.1(IN) IC8.1(IN) ; also sheet 3
+5VB: C7.1 C12.1 IC2.1(IN) IC3.1(IN) ; also sheet 3
AGND: C1.2 C11.2 R2.2 R8.2 USBA_1-2.S1(USBA:SHIELD) USBA_1-2.S2(USBA:SHIELD) USBA_1-2.S3(USBB:SHIELD) USBA_1-2.S4(USBB:SHIELD) USBA_3-4.S1(USBA:SHIELD) USBA_3-4.S2(USBA:SHIELD) USBA_3-4.S3(USBB:SHIELD) USBA_3-4.S4(USBB:SHIELD) ; also sheet 1,2,5,6,7,8,9,10,11,12
GND: C1.1 C2.2 C3.2 C4.2 C5.2 C7.2 C8.2 C9.2 C10.2 C11.1 C12.2 C13.2 C14.2 C15.2 C17.2 C18.2 C19.2 C20.2 C82.2 C83.2 C84.2 C85.2 D1.C D3.C D5.C D7.C IC1.2(GND) IC2.2(GND) IC3.2(GND) IC4.3(V-) IC5.3(V-) IC6.3(V-) IC7.3(V-) IC8.2(GND) R2.1 R3.2 R6.2 R8.1 R9.2 R84.2 USBA_1-2.4(USBA:GND) USBA_1-2.8(USBB:GND) USBA_3-4.4(USBA:GND) USBA_3-4.8(USBB:GND) ; also sheet 1,2,3,5,6,7,8,9,10,11,12
N$1: IC1.5(ILIM) R3.1
N$2: IC2.5(ILIM) R6.1
N$3: IC3.5(ILIM) R9.1
N$4: D2.A R12.1
N$5: IC4.4(OUT) R14.1
N$6: D1.A R14.2
N$7: D4.A R15.1
N$8: IC5.4(OUT) R17.1
N$9: D3.A R17.2
N$10: D6.A R18.1
N$11: IC6.4(OUT) R20.1
N$12: D5.A R20.2
N$13: D8.A R21.1
N$14: IC7.4(OUT) R23.1
N$15: D7.A R23.2
N$46: IC8.5(ILIM) R84.1
OCP1: D2.C IC4.2(IN) IC8.4(!FAULT) R13.1 ; also sheet 2
OCP2: D4.C IC1.4(!FAULT) IC5.2(IN) R16.1 ; also sheet 2
OCP3: D6.C IC2.4(!FAULT) IC6.2(IN) R19.1 ; also sheet 2
OCP4: D8.C IC3.4(!FAULT) IC7.2(IN) R22.1 ; also sheet 2
USBA1_EN: IC8.3(EN) R1.2 ; also sheet 2
USBA2_EN: IC1.3(EN) R4.2 ; also sheet 2
USBA3_EN: IC2.3(EN) R7.2 ; also sheet 2
USBA4_EN: IC3.3(EN) R10.2 ; also sheet 2
VBUS_USBA1: C83.1 C84.1 C85.1 IC8.6(OUT) USBA_1-2.1(USBA:VBUS) VUSBA1.TP
VBUS_USBA2: C3.1 C4.1 C5.1 IC1.6(OUT) USBA_1-2.5(USBB:VBUS) VUSBA2.TP
VBUS_USBA3: C8.1 C9.1 C10.1 IC2.6(OUT) USBA_3-4.1(USBA:VBUS) VUSBA3.TP
VBUS_USBA4: C13.1 C14.1 C15.1 IC3.6(OUT) USBA_3-4.5(USBB:VBUS) VUSBA4.TP
Unconnected: USBA_1-2.2(USBA:D-) USBA_1-2.3(USBA:D+) USBA_1-2.6(USBB:D-) USBA_1-2.7(USBB:D+) USBA_3-4.2(USBA:D-) USBA_3-4.3(USBA:D+) USBA_3-4.6(USBB:D-) USBA_3-4.7(USBB:D+)

### Notes on the sheet
- OUTPUT USB-A1 | OUTPUT USB-A2
- RLIM = 20kΩ = 1.2A | RLIM = 20kΩ = 1.2A
- OUTPUT USB-A3 | OUTPUT USB-A4
- RLIM = 20kΩ = 1.2A | RLIM = 20kΩ = 1.2A
- FAULT INDICATORS
- 4X USB-A OUTPUT
- PDNode-600 Pro
- DvidMakesThings
- David Sipos @2025 | v0.1.0

## Sheet 5 of 12: USB-C PD SOURCE PORT1
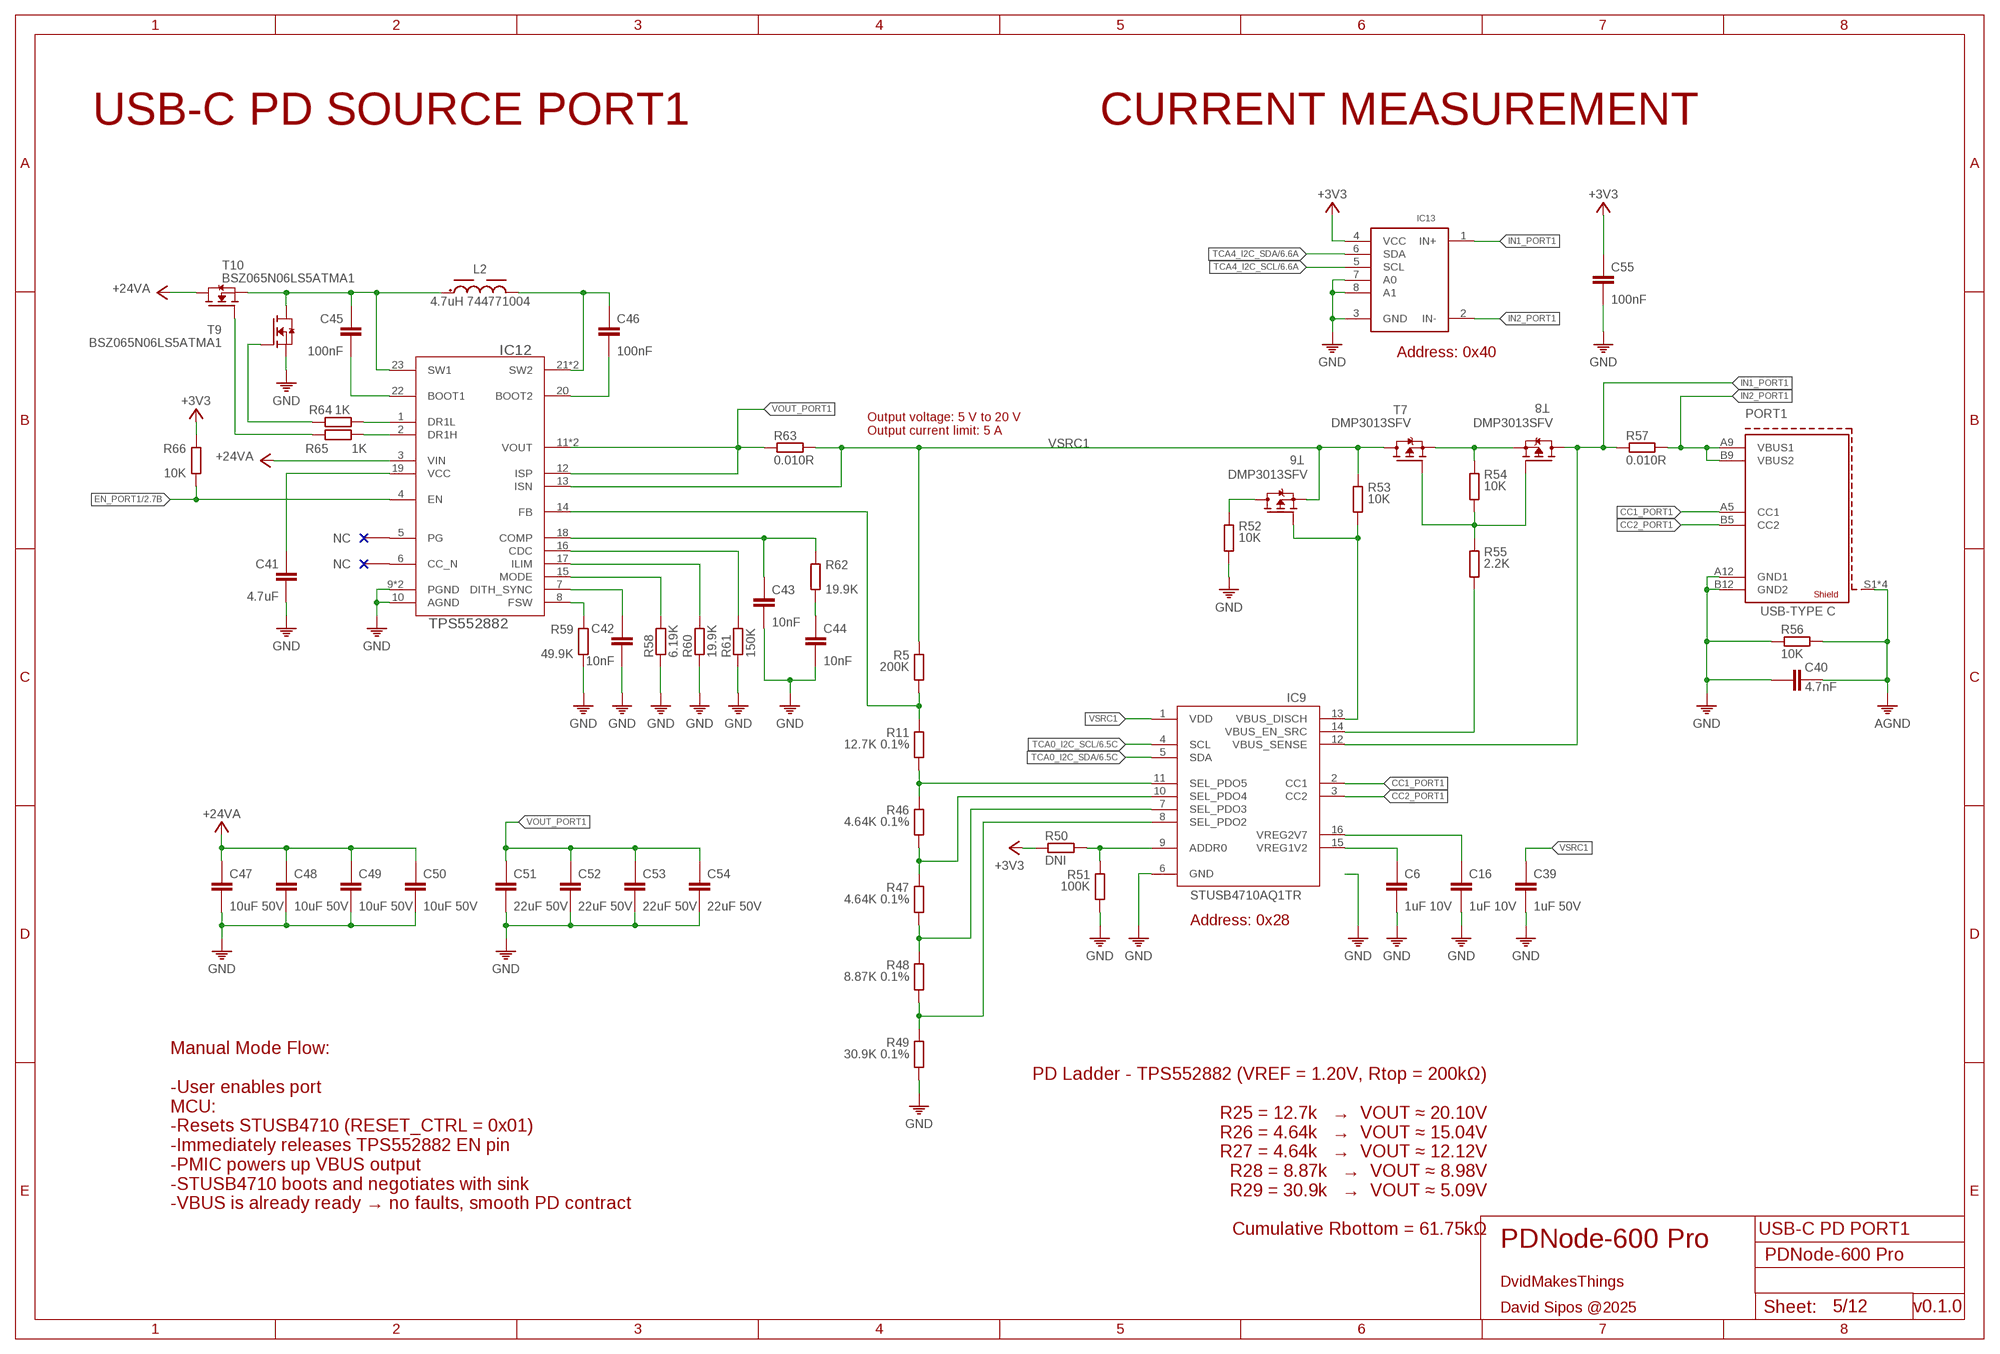
[diagram p4: schematic, sheet 5]

### Parts
C6  1uF 10V  C-0201  [0201]
C16  1uF 10V  C-0201  [0201]
C39  1uF 50V  C-0603  [C0603]
C40  4.7nF  C-0402  [C0402]
C41  4.7uF  C-0402  [C0402]
C42  10nF  C-0201  [0201]
C43  10nF  C-0201  [0201]
C44  10nF  C-0201  [0201]
C45  100nF  C-0402  [C0402]
C46  100nF  C-0402  [C0402]
C47  10uF 50V  C-0805  [C0805]
C48  10uF 50V  C-0805  [C0805]
C49  10uF 50V  C-0805  [C0805]
C50  10uF 50V  C-0805  [C0805]
C51  22uF 50V  C-0805  [C0805]
C52  22uF 50V  C-0805  [C0805]
C53  22uF 50V  C-0805  [C0805]
C54  22uF 50V  C-0805  [C0805]
C55  100nF  C-0201  [0201]
IC9  STUSB4710AQ1TR  [QFN50P300X300X55-16N]
IC12  TPS552882  [RPM0026A-MFG]
IC13  INA219BIDCNT  [SOT23-8]
L2  4.7uH 744771004  WE-PD_1280_74477004  [WE-PD_1280]
PORT1  632722100213  [632722100213]
R5  200K  R0201  [R0201]
R11  12.7K 0.1%  R0201  [R0201]
R46  4.64K 0.1%  R0201  [R0201]
R47  4.64K 0.1%  R0201  [R0201]
R48  8.87K 0.1%  R0201  [R0201]
R49  30.9K 0.1%  R0201  [R0201]
R50  DNI  R0201  [R0201]
R51  100K  R0201  [R0201]
R52  10K  R0402  [0402]
R53  10K  R0402  [0402]
R54  10K  R0201  [R0201]
R55  2.2K  R0201  [R0201]
R56  10K  R0402  [0402]
R57  0.010R  R2512  [2512]
R58  6.19K  R0201  [R0201]
R59  49.9K  R0201  [R0201]
R60  19.9K  R0201  [R0201]
R61  150K  R0201  [R0201]
R62  19.9K  R0201  [R0201]
R63  0.010R  R2512  [2512]
R64  1K  R0201  [R0201]
R65  1K  R0201  [R0201]
R66  10K  R0201  [R0201]
T6  DMP3013SFV  DMP3013SFV-7UX  [POWERDI3333-8_UX_DIO-L]
T7  DMP3013SFV  DMP3013SFV-7UX  [POWERDI3333-8_UX_DIO-L]
T8  DMP3013SFV  DMP3013SFV-7UX  [POWERDI3333-8_UX_DIO-L]
T9  BSZ065N06LS5ATMA1  IPZ40N04S5L7R4ATMA1  [POWERDI3333-8_UX_DIO-L]
T10  BSZ065N06LS5ATMA1  IPZ40N04S5L7R4ATMA1  [POWERDI3333-8_UX_DIO-L]

### Nets
+3V3: C55.1 IC13.4(VCC) R50.1 R66.1 ; also sheet 1,2,3,4,6,7,8,9,10,11,12
+24V_A: C47.1 C48.1 C49.1 C50.1 IC12.3(VIN) T10.5(D) T10.6(D) T10.7(D) T10.8(D) T10.9(D) ; supply symbol labelled +24VA ; also sheet 3,6,7,8
AGND: C40.2 PORT1.S1(SHIELD1) PORT1.S2(SHIELD1) PORT1.S3(SHIELD1) PORT1.S4(SHIELD1) R56.2 ; also sheet 1,2,4,6,7,8,9,10,11,12
CC1_PORT1: IC9.2(CC1) PORT1.A5(CC1)
CC2_PORT1: IC9.3(CC2) PORT1.B5(CC2)
EN_PORT1: IC12.4(EN) R66.2 ; also sheet 2
GND: C6.2 C16.2 C39.2 C40.1 C41.2 C42.2 C43.2 C44.2 C47.2 C48.2 C49.2 C50.2 C51.2 C52.2 C53.2 C54.2 C55.2 IC9.6(GND) IC12.9(PGND) IC12.10(AGND) IC12.24(PGND) IC13.3(GND) IC13.7(A0) IC13.8(A1) PORT1.A12(GND1) PORT1.B12(GND2) R49.2 R51.2 R52.2 R56.1 R58.2 R59.2 R60.2 R61.2 T9.1(S) T9.2(S) T9.3(S) ; also sheet 1,2,3,4,6,7,8,9,10,11,12
IN1_PORT1: IC9.12(VBUS_SENSE) IC13.1(IN+) R57.1 T8.5(D) T8.6(D) T8.7(D) T8.8(D) T8.9(D)
IN2_PORT1: IC13.2(IN-) PORT1.A9(VBUS1) PORT1.B9(VBUS2) R57.2
N$47: IC12.14(FB) R5.2 R11.1
N$48: IC9.11(SEL_PDO5) R11.2 R46.1
N$49: IC9.10(SEL_PDO4) R46.2 R47.1
N$50: IC9.7(SEL_PDO3) R47.2 R48.1
N$51: IC9.8(SEL_PDO2) R48.2 R49.1
N$52: C6.1 IC9.15(VREG1V2)
N$53: C16.1 IC9.16(VREG2V7)
N$54: IC9.9(ADDR0) R50.2 R51.1
N$55: R52.1 T6.5(D) T6.6(D) T6.7(D) T6.8(D) T6.9(D)
N$56: IC9.13(VBUS_DISCH) R53.2 T6.4(G)
N$57: R54.1 T7.1(S) T7.2(S) T7.3(S) T8.1(S) T8.2(S) T8.3(S)
N$58: R54.2 R55.1 T7.4(G) T8.4(G)
N$59: IC9.14(VBUS_EN_SRC) R55.2
N$60: C44.1 R62.2
N$61: IC12.8(FSW) R59.1
N$62: C42.1 IC12.7(DITH_SYNC)
N$63: IC12.15(MODE) R58.1
N$64: IC12.17(ILIM) R60.1
N$65: IC12.16(CDC) R61.1
N$66: C43.1 IC12.18(COMP) R62.1
N$67: C41.1 IC12.19(VCC)
N$68: C45.1 IC12.23(SW1) L2.1 T9.5(D) T9.6(D) T9.7(D) T9.8(D) T9.9(D) T10.1(S) T10.2(S) T10.3(S)
N$69: C46.1 IC12.21(SW2) IC12.25(SW2) L2.2
N$70: C45.2 IC12.22(BOOT1)
N$71: C46.2 IC12.20(BOOT2)
N$72: R65.2 T10.4(G)
N$73: R64.2 T9.4(G)
N$74: IC12.1(DR1L) R64.1
N$75: IC12.2(DR1H) R65.1
TCA0_I2C_SCL: IC9.4(SCL) ; also sheet 2,6
TCA0_I2C_SDA: IC9.5(SDA) ; also sheet 2,6
TCA4_I2C_SCL: IC13.5(SCL) ; also sheet 2,6,7,8
TCA4_I2C_SDA: IC13.6(SDA) ; also sheet 2,6,7,8
VOUT_PORT1: C51.1 C52.1 C53.1 C54.1 IC12.11(VOUT) IC12.12(ISP) IC12.26(VOUT) R63.1
VSRC1: C39.1 IC9.1(VDD) IC12.13(ISN) R5.1 R53.1 R63.2 T6.1(S) T6.2(S) T6.3(S) T7.5(D) T7.6(D) T7.7(D) T7.8(D) T7.9(D)
Unconnected: IC12.5(PG) IC12.6(CC_N)

### Notes on the sheet
- USB-C PD SOURCE PORT1 | CURRENT MEASUREMENT
- Address: 0x40
- Output voltage: 5 V to 20 V
  Output current limit: 5 A
- Address: 0x28
- PD Ladder - TPS552882 (VREF = 1.20V, Rtop = 200kΩ)
  
  R25 = 12.7k   →  VOUT ≈ 20.10V
  R26 = 4.64k   →  VOUT ≈ 15.04V
  R27 = 4.64k   →  VOUT ≈ 12.12V
  R28 = 8.87k   →  VOUT ≈ 8.98V
  R29 = 30.9k   →  VOUT ≈ 5.09V
  
  Cumulative Rbottom = 61.75kΩ
- Manual Mode Flow:
  
  -User enables port
  MCU:
  -Resets STUSB4710 (RESET_CTRL = 0x01)
  -Immediately releases TPS552882 EN pin
  -PMIC powers up VBUS output
  -STUSB4710 boots and negotiates with sink
  -VBUS is already ready → no faults, smooth PD contract
- USB-C PD PORT1
- PDNode-600 Pro
- DvidMakesThings
- David Sipos @2025 | v0.1.0

## Sheet 6 of 12: USB-C PD SOURCE PORT2
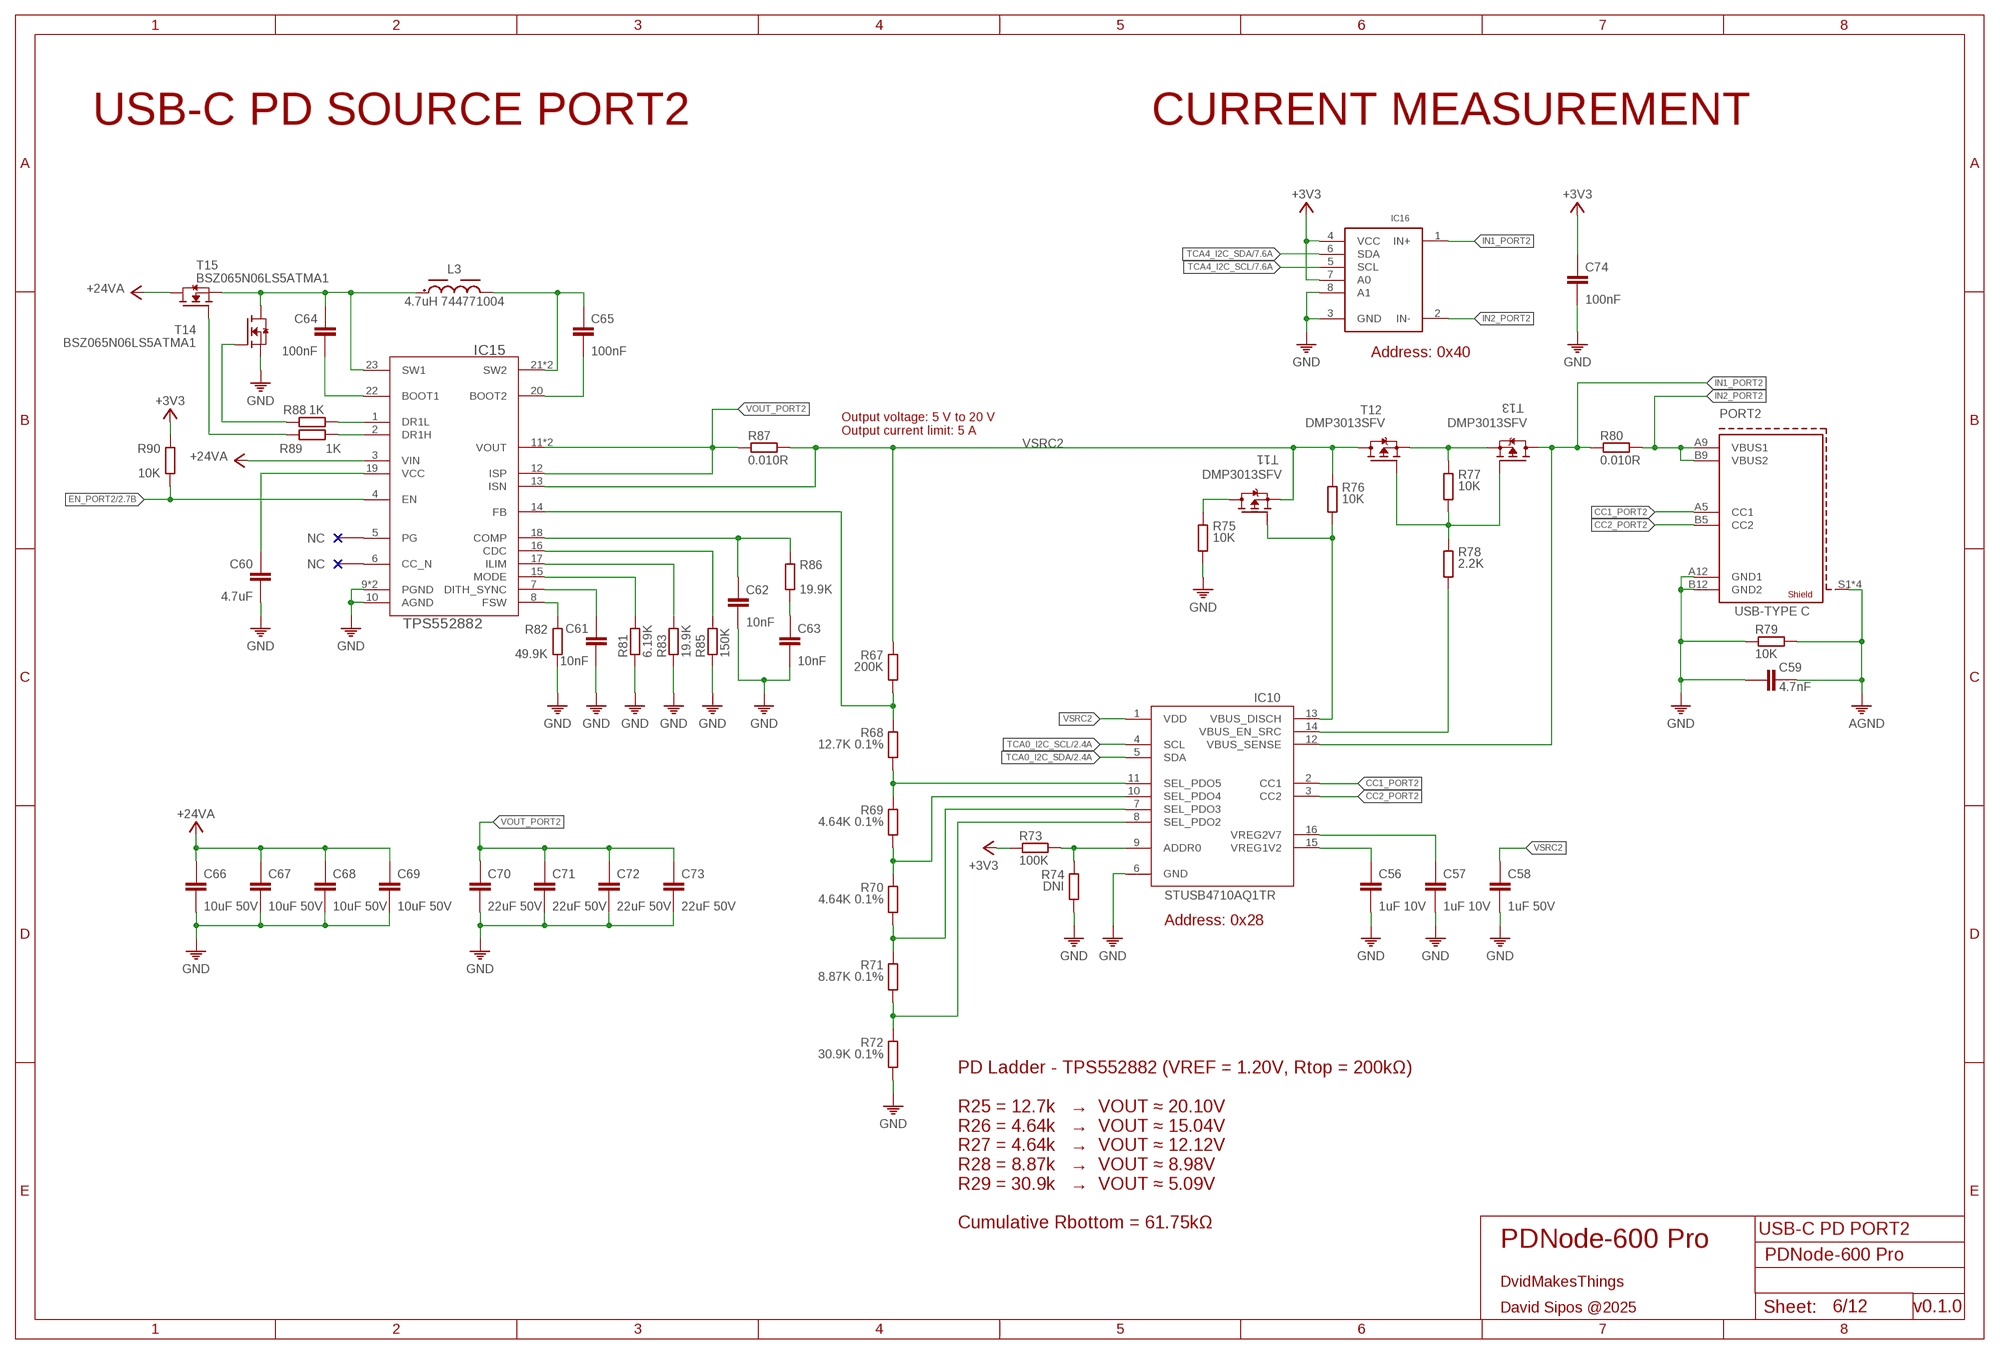
[diagram p5: schematic, sheet 6]

### Parts
C56  1uF 10V  C-0201  [0201]
C57  1uF 10V  C-0201  [0201]
C58  1uF 50V  C-0603  [C0603]
C59  4.7nF  C-0402  [C0402]
C60  4.7uF  C-0402  [C0402]
C61  10nF  C-0201  [0201]
C62  10nF  C-0201  [0201]
C63  10nF  C-0201  [0201]
C64  100nF  C-0402  [C0402]
C65  100nF  C-0402  [C0402]
C66  10uF 50V  C-0805  [C0805]
C67  10uF 50V  C-0805  [C0805]
C68  10uF 50V  C-0805  [C0805]
C69  10uF 50V  C-0805  [C0805]
C70  22uF 50V  C-0805  [C0805]
C71  22uF 50V  C-0805  [C0805]
C72  22uF 50V  C-0805  [C0805]
C73  22uF 50V  C-0805  [C0805]
C74  100nF  C-0201  [0201]
IC10  STUSB4710AQ1TR  [QFN50P300X300X55-16N]
IC15  TPS552882  [RPM0026A-MFG]
IC16  INA219BIDCNT  [SOT23-8]
L3  4.7uH 744771004  WE-PD_1280_74477004  [WE-PD_1280]
PORT2  632722100213  [632722100213]
R67  200K  R0201  [R0201]
R68  12.7K 0.1%  R0201  [R0201]
R69  4.64K 0.1%  R0201  [R0201]
R70  4.64K 0.1%  R0201  [R0201]
R71  8.87K 0.1%  R0201  [R0201]
R72  30.9K 0.1%  R0201  [R0201]
R73  100K  R0201  [R0201]
R74  DNI  R0201  [R0201]
R75  10K  R0402  [0402]
R76  10K  R0402  [0402]
R77  10K  R0201  [R0201]
R78  2.2K  R0201  [R0201]
R79  10K  R0402  [0402]
R80  0.010R  R2512  [2512]
R81  6.19K  R0201  [R0201]
R82  49.9K  R0201  [R0201]
R83  19.9K  R0201  [R0201]
R85  150K  R0201  [R0201]
R86  19.9K  R0201  [R0201]
R87  0.010R  R2512  [2512]
R88  1K  R0201  [R0201]
R89  1K  R0201  [R0201]
R90  10K  R0201  [R0201]
T11  DMP3013SFV  DMP3013SFV-7UX  [POWERDI3333-8_UX_DIO-L]
T12  DMP3013SFV  DMP3013SFV-7UX  [POWERDI3333-8_UX_DIO-L]
T13  DMP3013SFV  DMP3013SFV-7UX  [POWERDI3333-8_UX_DIO-L]
T14  BSZ065N06LS5ATMA1  IPZ40N04S5L7R4ATMA1  [POWERDI3333-8_UX_DIO-L]
T15  BSZ065N06LS5ATMA1  IPZ40N04S5L7R4ATMA1  [POWERDI3333-8_UX_DIO-L]

### Nets
+3V3: C74.1 IC16.4(VCC) IC16.7(A0) R73.1 R90.1 ; also sheet 1,2,3,4,5,7,8,9,10,11,12
+24V_A: C66.1 C67.1 C68.1 C69.1 IC15.3(VIN) T15.5(D) T15.6(D) T15.7(D) T15.8(D) T15.9(D) ; supply symbol labelled +24VA ; also sheet 3,5,7,8
AGND: C59.2 PORT2.S1(SHIELD1) PORT2.S2(SHIELD1) PORT2.S3(SHIELD1) PORT2.S4(SHIELD1) R79.2 ; also sheet 1,2,4,5,7,8,9,10,11,12
CC1_PORT2: IC10.2(CC1) PORT2.A5(CC1)
CC2_PORT2: IC10.3(CC2) PORT2.B5(CC2)
EN_PORT2: IC15.4(EN) R90.2 ; also sheet 2
GND: C56.2 C57.2 C58.2 C59.1 C60.2 C61.2 C62.2 C63.2 C66.2 C67.2 C68.2 C69.2 C70.2 C71.2 C72.2 C73.2 C74.2 IC10.6(GND) IC15.9(PGND) IC15.10(AGND) IC15.24(PGND) IC16.3(GND) IC16.8(A1) PORT2.A12(GND1) PORT2.B12(GND2) R72.2 R74.2 R75.2 R79.1 R81.2 R82.2 R83.2 R85.2 T14.1(S) T14.2(S) T14.3(S) ; also sheet 1,2,3,4,5,7,8,9,10,11,12
IN1_PORT2: IC10.12(VBUS_SENSE) IC16.1(IN+) R80.1 T13.5(D) T13.6(D) T13.7(D) T13.8(D) T13.9(D)
IN2_PORT2: IC16.2(IN-) PORT2.A9(VBUS1) PORT2.B9(VBUS2) R80.2
N$76: IC15.14(FB) R67.2 R68.1
N$77: IC10.11(SEL_PDO5) R68.2 R69.1
N$78: IC10.10(SEL_PDO4) R69.2 R70.1
N$79: IC10.7(SEL_PDO3) R70.2 R71.1
N$80: IC10.8(SEL_PDO2) R71.2 R72.1
N$81: C56.1 IC10.15(VREG1V2)
N$82: C57.1 IC10.16(VREG2V7)
N$83: IC10.9(ADDR0) R73.2 R74.1
N$84: R75.1 T11.5(D) T11.6(D) T11.7(D) T11.8(D) T11.9(D)
N$85: IC10.13(VBUS_DISCH) R76.2 T11.4(G)
N$86: R77.1 T12.1(S) T12.2(S) T12.3(S) T13.1(S) T13.2(S) T13.3(S)
N$87: R77.2 R78.1 T12.4(G) T13.4(G)
N$88: IC10.14(VBUS_EN_SRC) R78.2
N$89: C63.1 R86.2
N$90: IC15.8(FSW) R82.1
N$91: C61.1 IC15.7(DITH_SYNC)
N$92: IC15.15(MODE) R81.1
N$93: IC15.17(ILIM) R83.1
N$94: IC15.16(CDC) R85.1
N$95: C62.1 IC15.18(COMP) R86.1
N$96: C60.1 IC15.19(VCC)
N$97: C64.1 IC15.23(SW1) L3.1 T14.5(D) T14.6(D) T14.7(D) T14.8(D) T14.9(D) T15.1(S) T15.2(S) T15.3(S)
N$98: C65.1 IC15.21(SW2) IC15.25(SW2) L3.2
N$99: C64.2 IC15.22(BOOT1)
N$100: C65.2 IC15.20(BOOT2)
N$101: R89.2 T15.4(G)
N$102: R88.2 T14.4(G)
N$103: IC15.1(DR1L) R88.1
N$104: IC15.2(DR1H) R89.1
TCA0_I2C_SCL: IC10.4(SCL) ; also sheet 2,5
TCA0_I2C_SDA: IC10.5(SDA) ; also sheet 2,5
TCA4_I2C_SCL: IC16.5(SCL) ; also sheet 2,5,7,8
TCA4_I2C_SDA: IC16.6(SDA) ; also sheet 2,5,7,8
VOUT_PORT2: C70.1 C71.1 C72.1 C73.1 IC15.11(VOUT) IC15.12(ISP) IC15.26(VOUT) R87.1
VSRC2: C58.1 IC10.1(VDD) IC15.13(ISN) R67.1 R76.1 R87.2 T11.1(S) T11.2(S) T11.3(S) T12.5(D) T12.6(D) T12.7(D) T12.8(D) T12.9(D)
Unconnected: IC15.5(PG) IC15.6(CC_N)

### Notes on the sheet
- USB-C PD SOURCE PORT2 | CURRENT MEASUREMENT
- Address: 0x40
- Output voltage: 5 V to 20 V
  Output current limit: 5 A
- Address: 0x28
- USB-C PD PORT2
- PD Ladder - TPS552882 (VREF = 1.20V, Rtop = 200kΩ)
  
  R25 = 12.7k   →  VOUT ≈ 20.10V
  R26 = 4.64k   →  VOUT ≈ 15.04V
  R27 = 4.64k   →  VOUT ≈ 12.12V
  R28 = 8.87k   →  VOUT ≈ 8.98V
  R29 = 30.9k   →  VOUT ≈ 5.09V
  
  Cumulative Rbottom = 61.75kΩ
- PDNode-600 Pro
- DvidMakesThings
- David Sipos @2025 | v0.1.0

## Sheet 7 of 12: USB-C PD SOURCE PORT3
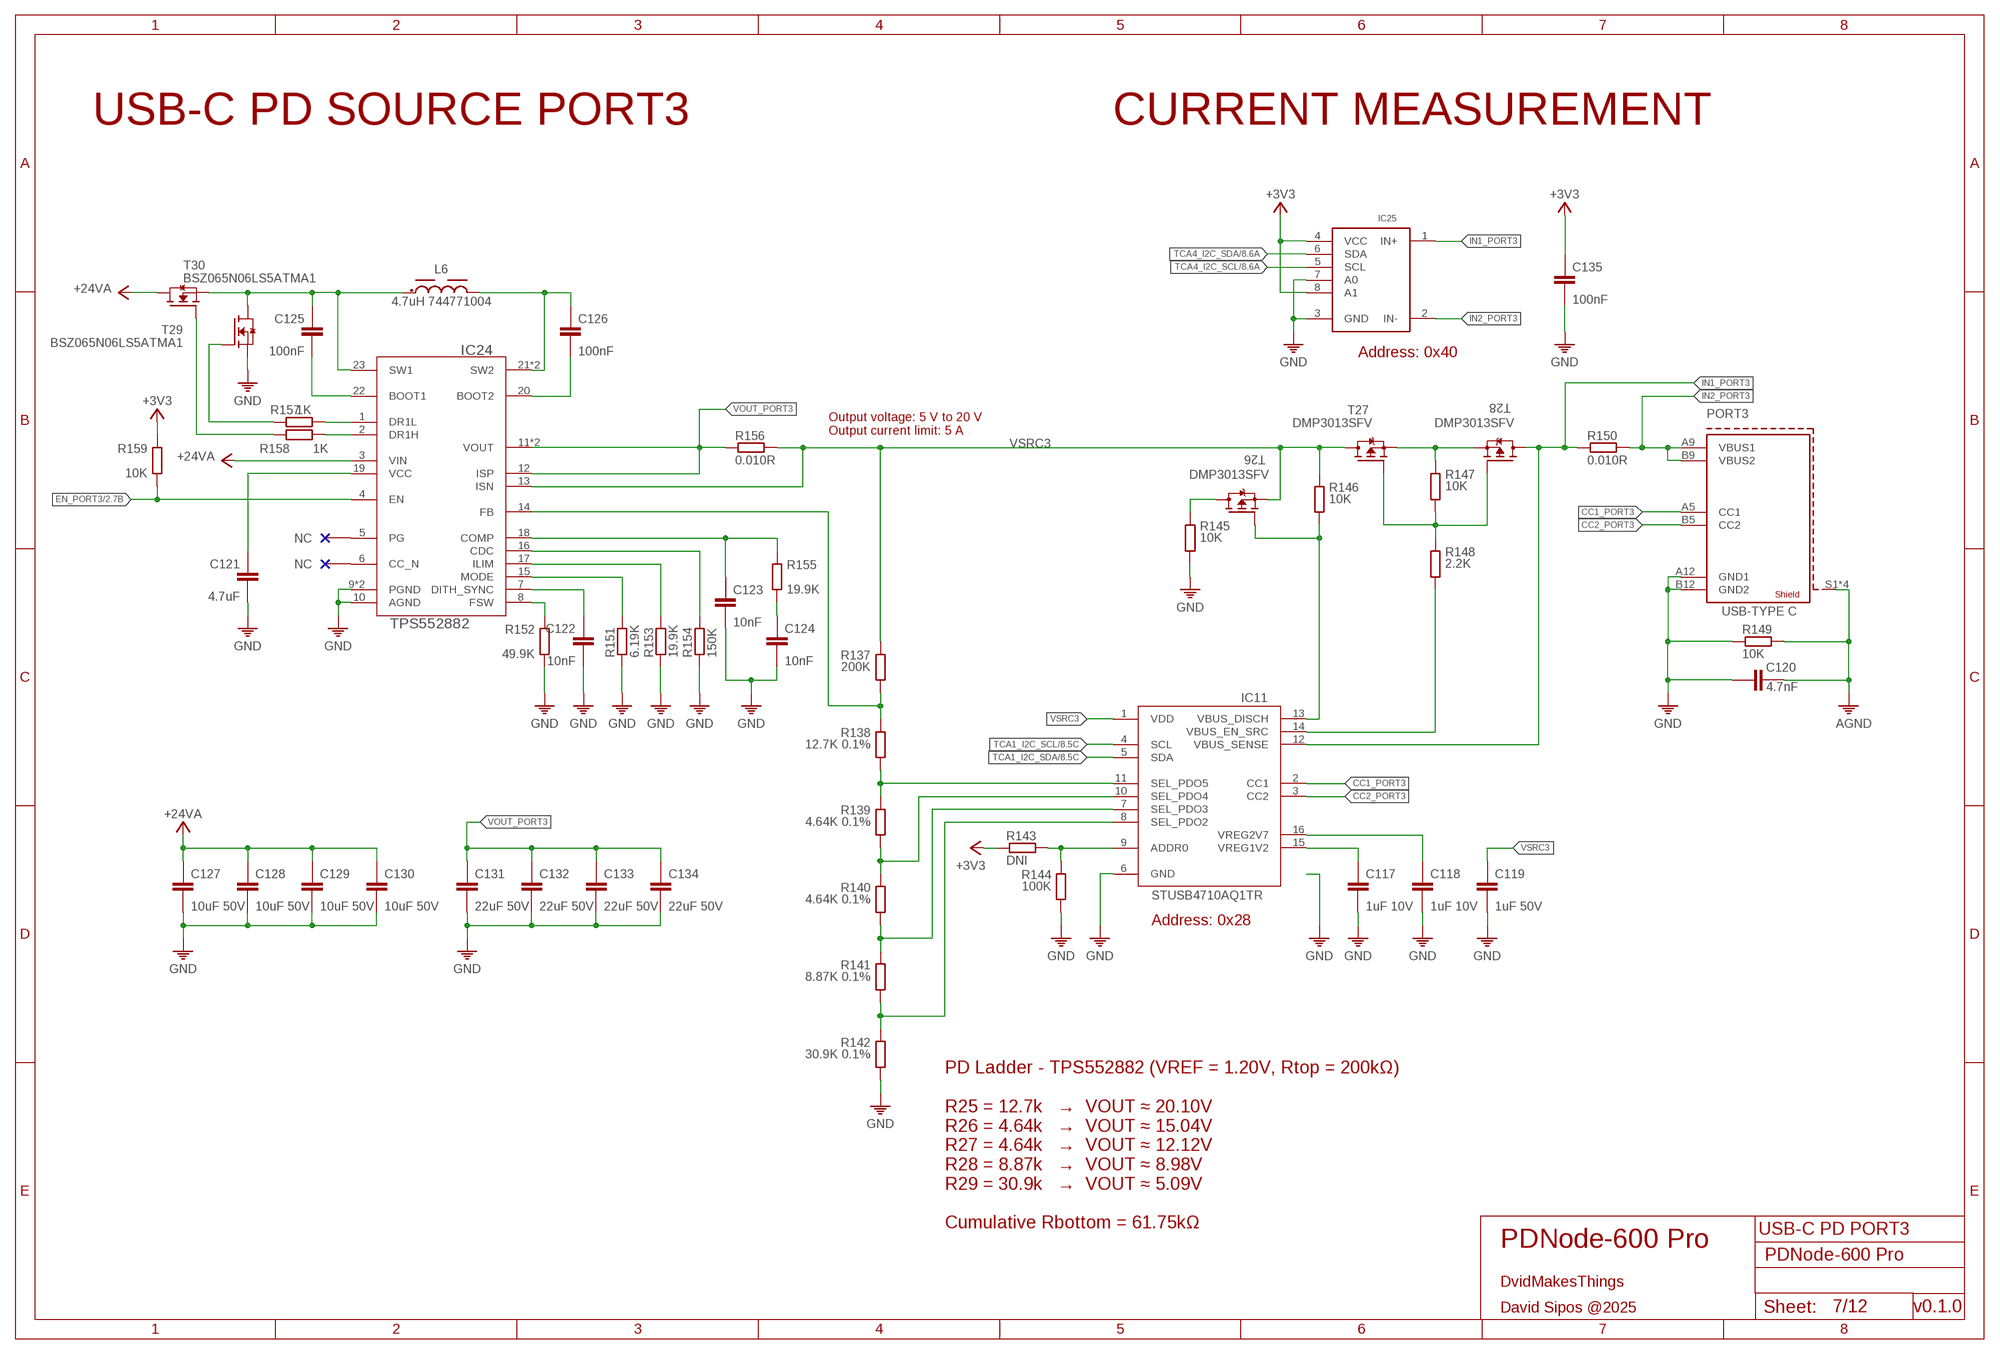
[diagram p6: schematic, sheet 7]

### Parts
C117  1uF 10V  C-0201  [0201]
C118  1uF 10V  C-0201  [0201]
C119  1uF 50V  C-0603  [C0603]
C120  4.7nF  C-0402  [C0402]
C121  4.7uF  C-0402  [C0402]
C122  10nF  C-0201  [0201]
C123  10nF  C-0201  [0201]
C124  10nF  C-0201  [0201]
C125  100nF  C-0402  [C0402]
C126  100nF  C-0402  [C0402]
C127  10uF 50V  C-0805  [C0805]
C128  10uF 50V  C-0805  [C0805]
C129  10uF 50V  C-0805  [C0805]
C130  10uF 50V  C-0805  [C0805]
C131  22uF 50V  C-0805  [C0805]
C132  22uF 50V  C-0805  [C0805]
C133  22uF 50V  C-0805  [C0805]
C134  22uF 50V  C-0805  [C0805]
C135  100nF  C-0201  [0201]
IC11  STUSB4710AQ1TR  [QFN50P300X300X55-16N]
IC24  TPS552882  [RPM0026A-MFG]
IC25  INA219BIDCNT  [SOT23-8]
L6  4.7uH 744771004  WE-PD_1280_74477004  [WE-PD_1280]
PORT3  632722100213  [632722100213]
R137  200K  R0201  [R0201]
R138  12.7K 0.1%  R0201  [R0201]
R139  4.64K 0.1%  R0201  [R0201]
R140  4.64K 0.1%  R0201  [R0201]
R141  8.87K 0.1%  R0201  [R0201]
R142  30.9K 0.1%  R0201  [R0201]
R143  DNI  R0201  [R0201]
R144  100K  R0201  [R0201]
R145  10K  R0402  [0402]
R146  10K  R0402  [0402]
R147  10K  R0201  [R0201]
R148  2.2K  R0201  [R0201]
R149  10K  R0402  [0402]
R150  0.010R  R2512  [2512]
R151  6.19K  R0201  [R0201]
R152  49.9K  R0201  [R0201]
R153  19.9K  R0201  [R0201]
R154  150K  R0201  [R0201]
R155  19.9K  R0201  [R0201]
R156  0.010R  R2512  [2512]
R157  1K  R0201  [R0201]
R158  1K  R0201  [R0201]
R159  10K  R0201  [R0201]
T26  DMP3013SFV  DMP3013SFV-7UX  [POWERDI3333-8_UX_DIO-L]
T27  DMP3013SFV  DMP3013SFV-7UX  [POWERDI3333-8_UX_DIO-L]
T28  DMP3013SFV  DMP3013SFV-7UX  [POWERDI3333-8_UX_DIO-L]
T29  BSZ065N06LS5ATMA1  IPZ40N04S5L7R4ATMA1  [POWERDI3333-8_UX_DIO-L]
T30  BSZ065N06LS5ATMA1  IPZ40N04S5L7R4ATMA1  [POWERDI3333-8_UX_DIO-L]

### Nets
+3V3: C135.1 IC25.4(VCC) IC25.8(A1) R143.1 R159.1 ; also sheet 1,2,3,4,5,6,8,9,10,11,12
+24V_A: C127.1 C128.1 C129.1 C130.1 IC24.3(VIN) T30.5(D) T30.6(D) T30.7(D) T30.8(D) T30.9(D) ; supply symbol labelled +24VA ; also sheet 3,5,6,8
AGND: C120.2 PORT3.S1(SHIELD1) PORT3.S2(SHIELD1) PORT3.S3(SHIELD1) PORT3.S4(SHIELD1) R149.2 ; also sheet 1,2,4,5,6,8,9,10,11,12
CC1_PORT3: IC11.2(CC1) PORT3.A5(CC1)
CC2_PORT3: IC11.3(CC2) PORT3.B5(CC2)
EN_PORT3: IC24.4(EN) R159.2 ; also sheet 2
GND: C117.2 C118.2 C119.2 C120.1 C121.2 C122.2 C123.2 C124.2 C127.2 C128.2 C129.2 C130.2 C131.2 C132.2 C133.2 C134.2 C135.2 IC11.6(GND) IC24.9(PGND) IC24.10(AGND) IC24.24(PGND) IC25.3(GND) IC25.7(A0) PORT3.A12(GND1) PORT3.B12(GND2) R142.2 R144.2 R145.2 R149.1 R151.2 R152.2 R153.2 R154.2 T29.1(S) T29.2(S) T29.3(S) ; also sheet 1,2,3,4,5,6,8,9,10,11,12
IN1_PORT3: IC11.12(VBUS_SENSE) IC25.1(IN+) R150.1 T28.5(D) T28.6(D) T28.7(D) T28.8(D) T28.9(D)
IN2_PORT3: IC25.2(IN-) PORT3.A9(VBUS1) PORT3.B9(VBUS2) R150.2
N$163: IC24.14(FB) R137.2 R138.1
N$164: IC11.11(SEL_PDO5) R138.2 R139.1
N$165: IC11.10(SEL_PDO4) R139.2 R140.1
N$166: IC11.7(SEL_PDO3) R140.2 R141.1
N$167: IC11.8(SEL_PDO2) R141.2 R142.1
N$168: C117.1 IC11.15(VREG1V2)
N$169: C118.1 IC11.16(VREG2V7)
N$170: IC11.9(ADDR0) R143.2 R144.1
N$171: R145.1 T26.5(D) T26.6(D) T26.7(D) T26.8(D) T26.9(D)
N$172: IC11.13(VBUS_DISCH) R146.2 T26.4(G)
N$173: R147.1 T27.1(S) T27.2(S) T27.3(S) T28.1(S) T28.2(S) T28.3(S)
N$174: R147.2 R148.1 T27.4(G) T28.4(G)
N$175: IC11.14(VBUS_EN_SRC) R148.2
N$176: C124.1 R155.2
N$177: IC24.8(FSW) R152.1
N$178: C122.1 IC24.7(DITH_SYNC)
N$179: IC24.15(MODE) R151.1
N$180: IC24.17(ILIM) R153.1
N$181: IC24.16(CDC) R154.1
N$182: C123.1 IC24.18(COMP) R155.1
N$183: C121.1 IC24.19(VCC)
N$184: C125.1 IC24.23(SW1) L6.1 T29.5(D) T29.6(D) T29.7(D) T29.8(D) T29.9(D) T30.1(S) T30.2(S) T30.3(S)
N$185: C126.1 IC24.21(SW2) IC24.25(SW2) L6.2
N$186: C125.2 IC24.22(BOOT1)
N$187: C126.2 IC24.20(BOOT2)
N$188: R158.2 T30.4(G)
N$189: R157.2 T29.4(G)
N$190: IC24.1(DR1L) R157.1
N$191: IC24.2(DR1H) R158.1
TCA1_I2C_SCL: IC11.4(SCL) ; also sheet 2,8
TCA1_I2C_SDA: IC11.5(SDA) ; also sheet 2,8
TCA4_I2C_SCL: IC25.5(SCL) ; also sheet 2,5,6,8
TCA4_I2C_SDA: IC25.6(SDA) ; also sheet 2,5,6,8
VOUT_PORT3: C131.1 C132.1 C133.1 C134.1 IC24.11(VOUT) IC24.12(ISP) IC24.26(VOUT) R156.1
VSRC3: C119.1 IC11.1(VDD) IC24.13(ISN) R137.1 R146.1 R156.2 T26.1(S) T26.2(S) T26.3(S) T27.5(D) T27.6(D) T27.7(D) T27.8(D) T27.9(D)
Unconnected: IC24.5(PG) IC24.6(CC_N)

### Notes on the sheet
- USB-C PD SOURCE PORT3 | CURRENT MEASUREMENT
- Address: 0x40
- Output voltage: 5 V to 20 V
  Output current limit: 5 A
- Address: 0x28
- USB-C PD PORT3
- PD Ladder - TPS552882 (VREF = 1.20V, Rtop = 200kΩ)
  
  R25 = 12.7k   →  VOUT ≈ 20.10V
  R26 = 4.64k   →  VOUT ≈ 15.04V
  R27 = 4.64k   →  VOUT ≈ 12.12V
  R28 = 8.87k   →  VOUT ≈ 8.98V
  R29 = 30.9k   →  VOUT ≈ 5.09V
  
  Cumulative Rbottom = 61.75kΩ
- PDNode-600 Pro
- DvidMakesThings
- David Sipos @2025 | v0.1.0

## Sheet 8 of 12: USB-C PD SOURCE PORT4
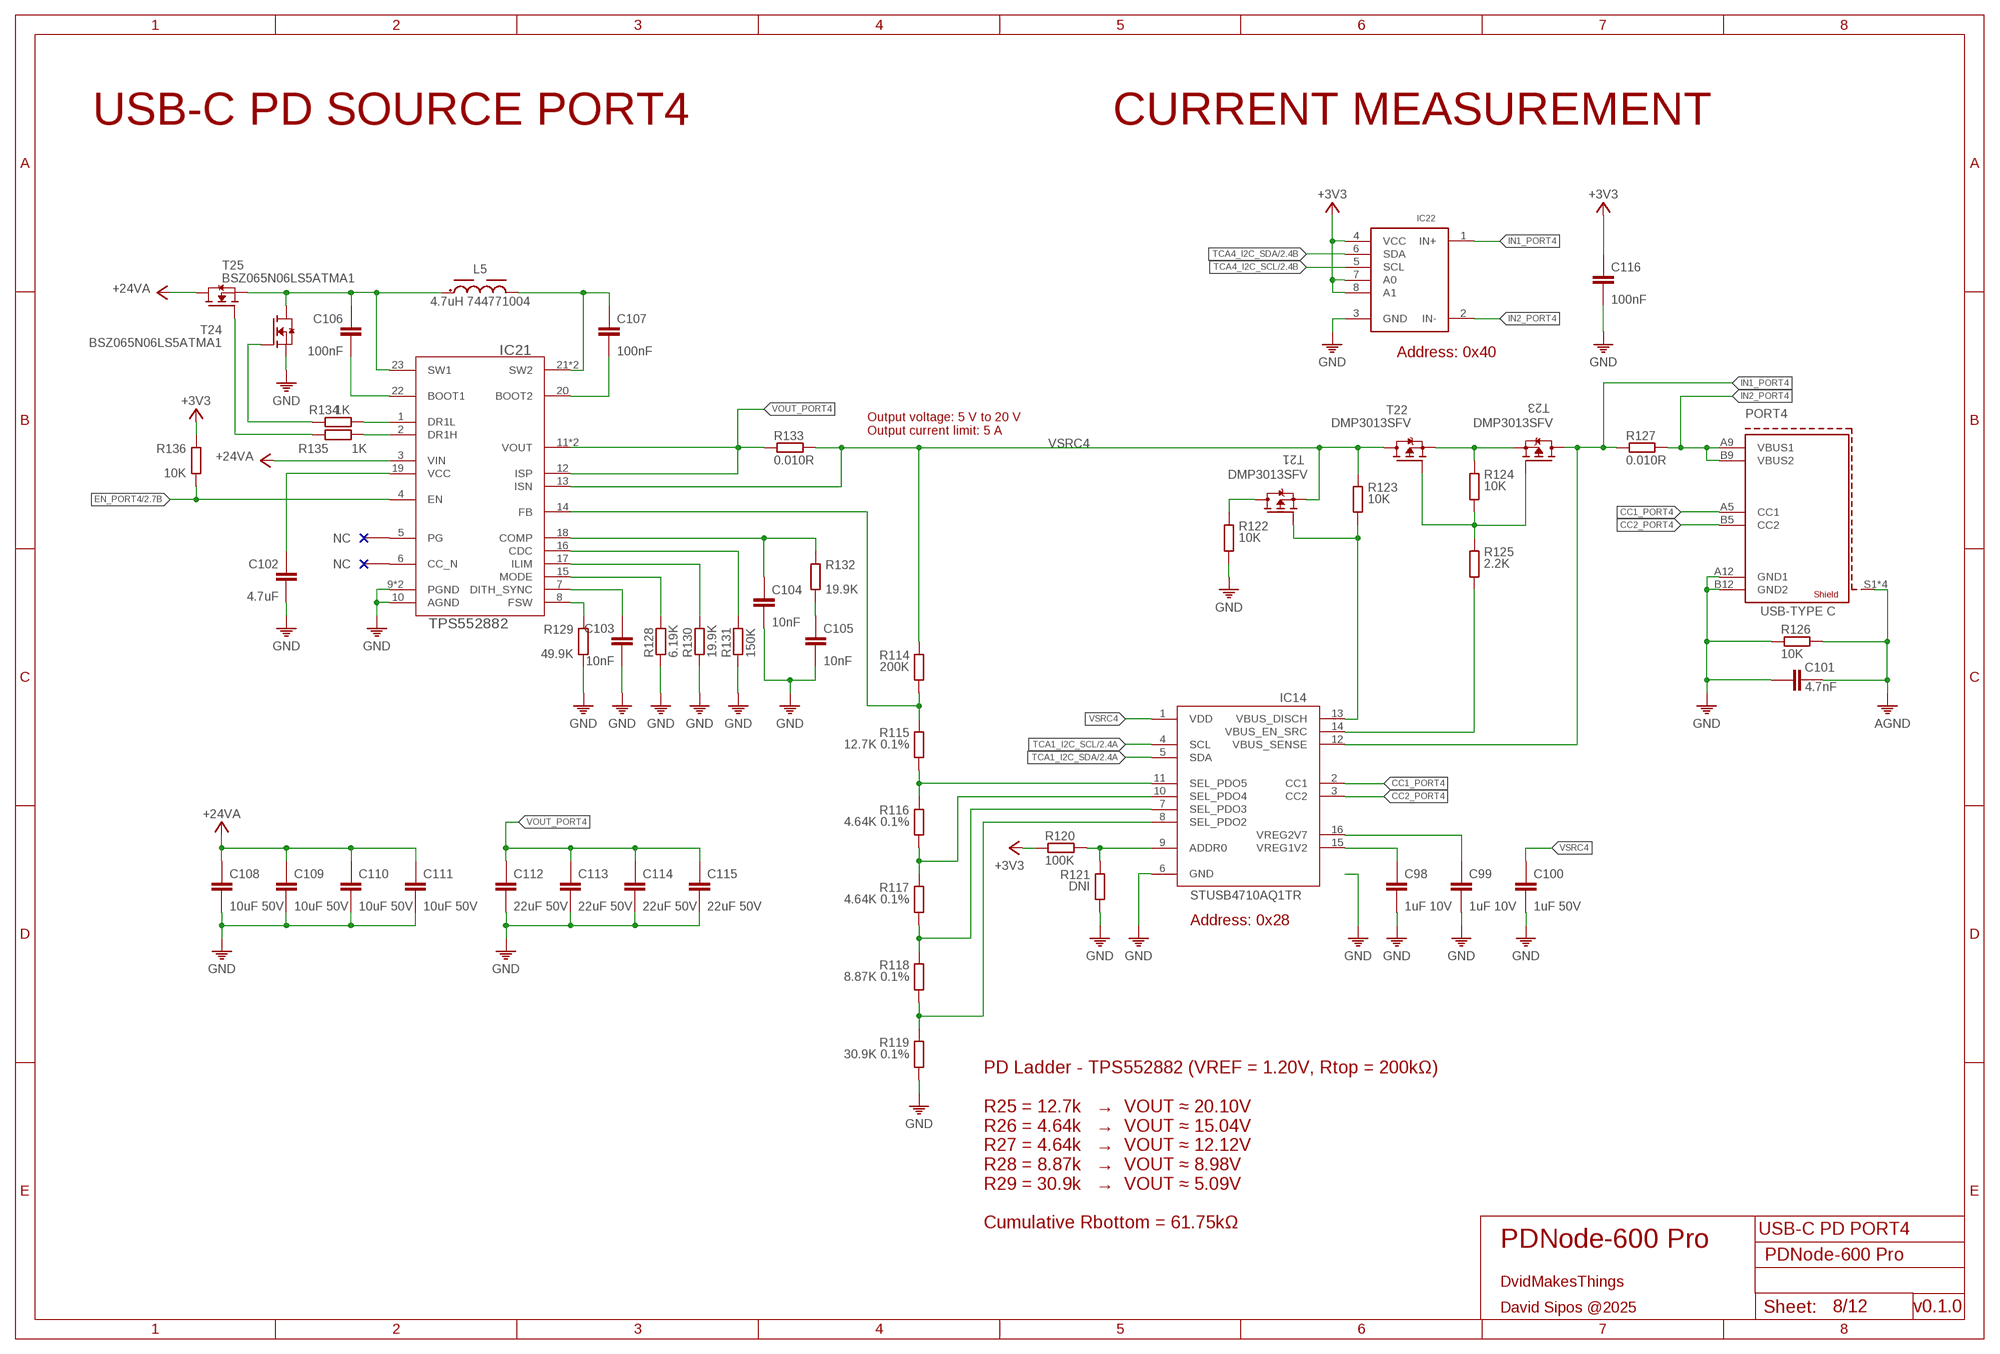
[diagram p7: schematic, sheet 8]

### Parts
C98  1uF 10V  C-0201  [0201]
C99  1uF 10V  C-0201  [0201]
C100  1uF 50V  C-0603  [C0603]
C101  4.7nF  C-0402  [C0402]
C102  4.7uF  C-0402  [C0402]
C103  10nF  C-0201  [0201]
C104  10nF  C-0201  [0201]
C105  10nF  C-0201  [0201]
C106  100nF  C-0402  [C0402]
C107  100nF  C-0402  [C0402]
C108  10uF 50V  C-0805  [C0805]
C109  10uF 50V  C-0805  [C0805]
C110  10uF 50V  C-0805  [C0805]
C111  10uF 50V  C-0805  [C0805]
C112  22uF 50V  C-0805  [C0805]
C113  22uF 50V  C-0805  [C0805]
C114  22uF 50V  C-0805  [C0805]
C115  22uF 50V  C-0805  [C0805]
C116  100nF  C-0201  [0201]
IC14  STUSB4710AQ1TR  [QFN50P300X300X55-16N]
IC21  TPS552882  [RPM0026A-MFG]
IC22  INA219BIDCNT  [SOT23-8]
L5  4.7uH 744771004  WE-PD_1280_74477004  [WE-PD_1280]
PORT4  632722100213  [632722100213]
R114  200K  R0201  [R0201]
R115  12.7K 0.1%  R0201  [R0201]
R116  4.64K 0.1%  R0201  [R0201]
R117  4.64K 0.1%  R0201  [R0201]
R118  8.87K 0.1%  R0201  [R0201]
R119  30.9K 0.1%  R0201  [R0201]
R120  100K  R0201  [R0201]
R121  DNI  R0201  [R0201]
R122  10K  R0402  [0402]
R123  10K  R0402  [0402]
R124  10K  R0201  [R0201]
R125  2.2K  R0201  [R0201]
R126  10K  R0402  [0402]
R127  0.010R  R2512  [2512]
R128  6.19K  R0201  [R0201]
R129  49.9K  R0201  [R0201]
R130  19.9K  R0201  [R0201]
R131  150K  R0201  [R0201]
R132  19.9K  R0201  [R0201]
R133  0.010R  R2512  [2512]
R134  1K  R0201  [R0201]
R135  1K  R0201  [R0201]
R136  10K  R0201  [R0201]
T21  DMP3013SFV  DMP3013SFV-7UX  [POWERDI3333-8_UX_DIO-L]
T22  DMP3013SFV  DMP3013SFV-7UX  [POWERDI3333-8_UX_DIO-L]
T23  DMP3013SFV  DMP3013SFV-7UX  [POWERDI3333-8_UX_DIO-L]
T24  BSZ065N06LS5ATMA1  IPZ40N04S5L7R4ATMA1  [POWERDI3333-8_UX_DIO-L]
T25  BSZ065N06LS5ATMA1  IPZ40N04S5L7R4ATMA1  [POWERDI3333-8_UX_DIO-L]

### Nets
+3V3: C116.1 IC22.4(VCC) IC22.7(A0) IC22.8(A1) R120.1 R136.1 ; also sheet 1,2,3,4,5,6,7,9,10,11,12
+24V_A: C108.1 C109.1 C110.1 C111.1 IC21.3(VIN) T25.5(D) T25.6(D) T25.7(D) T25.8(D) T25.9(D) ; supply symbol labelled +24VA ; also sheet 3,5,6,7
AGND: C101.2 PORT4.S1(SHIELD1) PORT4.S2(SHIELD1) PORT4.S3(SHIELD1) PORT4.S4(SHIELD1) R126.2 ; also sheet 1,2,4,5,6,7,9,10,11,12
CC1_PORT4: IC14.2(CC1) PORT4.A5(CC1)
CC2_PORT4: IC14.3(CC2) PORT4.B5(CC2)
EN_PORT4: IC21.4(EN) R136.2 ; also sheet 2
GND: C98.2 C99.2 C100.2 C101.1 C102.2 C103.2 C104.2 C105.2 C108.2 C109.2 C110.2 C111.2 C112.2 C113.2 C114.2 C115.2 C116.2 IC14.6(GND) IC21.9(PGND) IC21.10(AGND) IC21.24(PGND) IC22.3(GND) PORT4.A12(GND1) PORT4.B12(GND2) R119.2 R121.2 R122.2 R126.1 R128.2 R129.2 R130.2 R131.2 T24.1(S) T24.2(S) T24.3(S) ; also sheet 1,2,3,4,5,6,7,9,10,11,12
IN1_PORT4: IC14.12(VBUS_SENSE) IC22.1(IN+) R127.1 T23.5(D) T23.6(D) T23.7(D) T23.8(D) T23.9(D)
IN2_PORT4: IC22.2(IN-) PORT4.A9(VBUS1) PORT4.B9(VBUS2) R127.2
N$134: IC21.14(FB) R114.2 R115.1
N$135: IC14.11(SEL_PDO5) R115.2 R116.1
N$136: IC14.10(SEL_PDO4) R116.2 R117.1
N$137: IC14.7(SEL_PDO3) R117.2 R118.1
N$138: IC14.8(SEL_PDO2) R118.2 R119.1
N$139: C98.1 IC14.15(VREG1V2)
N$140: C99.1 IC14.16(VREG2V7)
N$141: IC14.9(ADDR0) R120.2 R121.1
N$142: R122.1 T21.5(D) T21.6(D) T21.7(D) T21.8(D) T21.9(D)
N$143: IC14.13(VBUS_DISCH) R123.2 T21.4(G)
N$144: R124.1 T22.1(S) T22.2(S) T22.3(S) T23.1(S) T23.2(S) T23.3(S)
N$145: R124.2 R125.1 T22.4(G) T23.4(G)
N$146: IC14.14(VBUS_EN_SRC) R125.2
N$147: C105.1 R132.2
N$148: IC21.8(FSW) R129.1
N$149: C103.1 IC21.7(DITH_SYNC)
N$150: IC21.15(MODE) R128.1
N$151: IC21.17(ILIM) R130.1
N$152: IC21.16(CDC) R131.1
N$153: C104.1 IC21.18(COMP) R132.1
N$154: C102.1 IC21.19(VCC)
N$155: C106.1 IC21.23(SW1) L5.1 T24.5(D) T24.6(D) T24.7(D) T24.8(D) T24.9(D) T25.1(S) T25.2(S) T25.3(S)
N$156: C107.1 IC21.21(SW2) IC21.25(SW2) L5.2
N$157: C106.2 IC21.22(BOOT1)
N$158: C107.2 IC21.20(BOOT2)
N$159: R135.2 T25.4(G)
N$160: R134.2 T24.4(G)
N$161: IC21.1(DR1L) R134.1
N$162: IC21.2(DR1H) R135.1
TCA1_I2C_SCL: IC14.4(SCL) ; also sheet 2,7
TCA1_I2C_SDA: IC14.5(SDA) ; also sheet 2,7
TCA4_I2C_SCL: IC22.5(SCL) ; also sheet 2,5,6,7
TCA4_I2C_SDA: IC22.6(SDA) ; also sheet 2,5,6,7
VOUT_PORT4: C112.1 C113.1 C114.1 C115.1 IC21.11(VOUT) IC21.12(ISP) IC21.26(VOUT) R133.1
VSRC4: C100.1 IC14.1(VDD) IC21.13(ISN) R114.1 R123.1 R133.2 T21.1(S) T21.2(S) T21.3(S) T22.5(D) T22.6(D) T22.7(D) T22.8(D) T22.9(D)
Unconnected: IC21.5(PG) IC21.6(CC_N)

### Notes on the sheet
- USB-C PD SOURCE PORT4 | CURRENT MEASUREMENT
- Address: 0x40
- Output voltage: 5 V to 20 V
  Output current limit: 5 A
- Address: 0x28
- USB-C PD PORT4
- PD Ladder - TPS552882 (VREF = 1.20V, Rtop = 200kΩ)
  
  R25 = 12.7k   →  VOUT ≈ 20.10V
  R26 = 4.64k   →  VOUT ≈ 15.04V
  R27 = 4.64k   →  VOUT ≈ 12.12V
  R28 = 8.87k   →  VOUT ≈ 8.98V
  R29 = 30.9k   →  VOUT ≈ 5.09V
  
  Cumulative Rbottom = 61.75kΩ
- PDNode-600 Pro
- DvidMakesThings
- David Sipos @2025 | v0.1.0

## Sheet 9 of 12: USB-C PD SOURCE PORT5
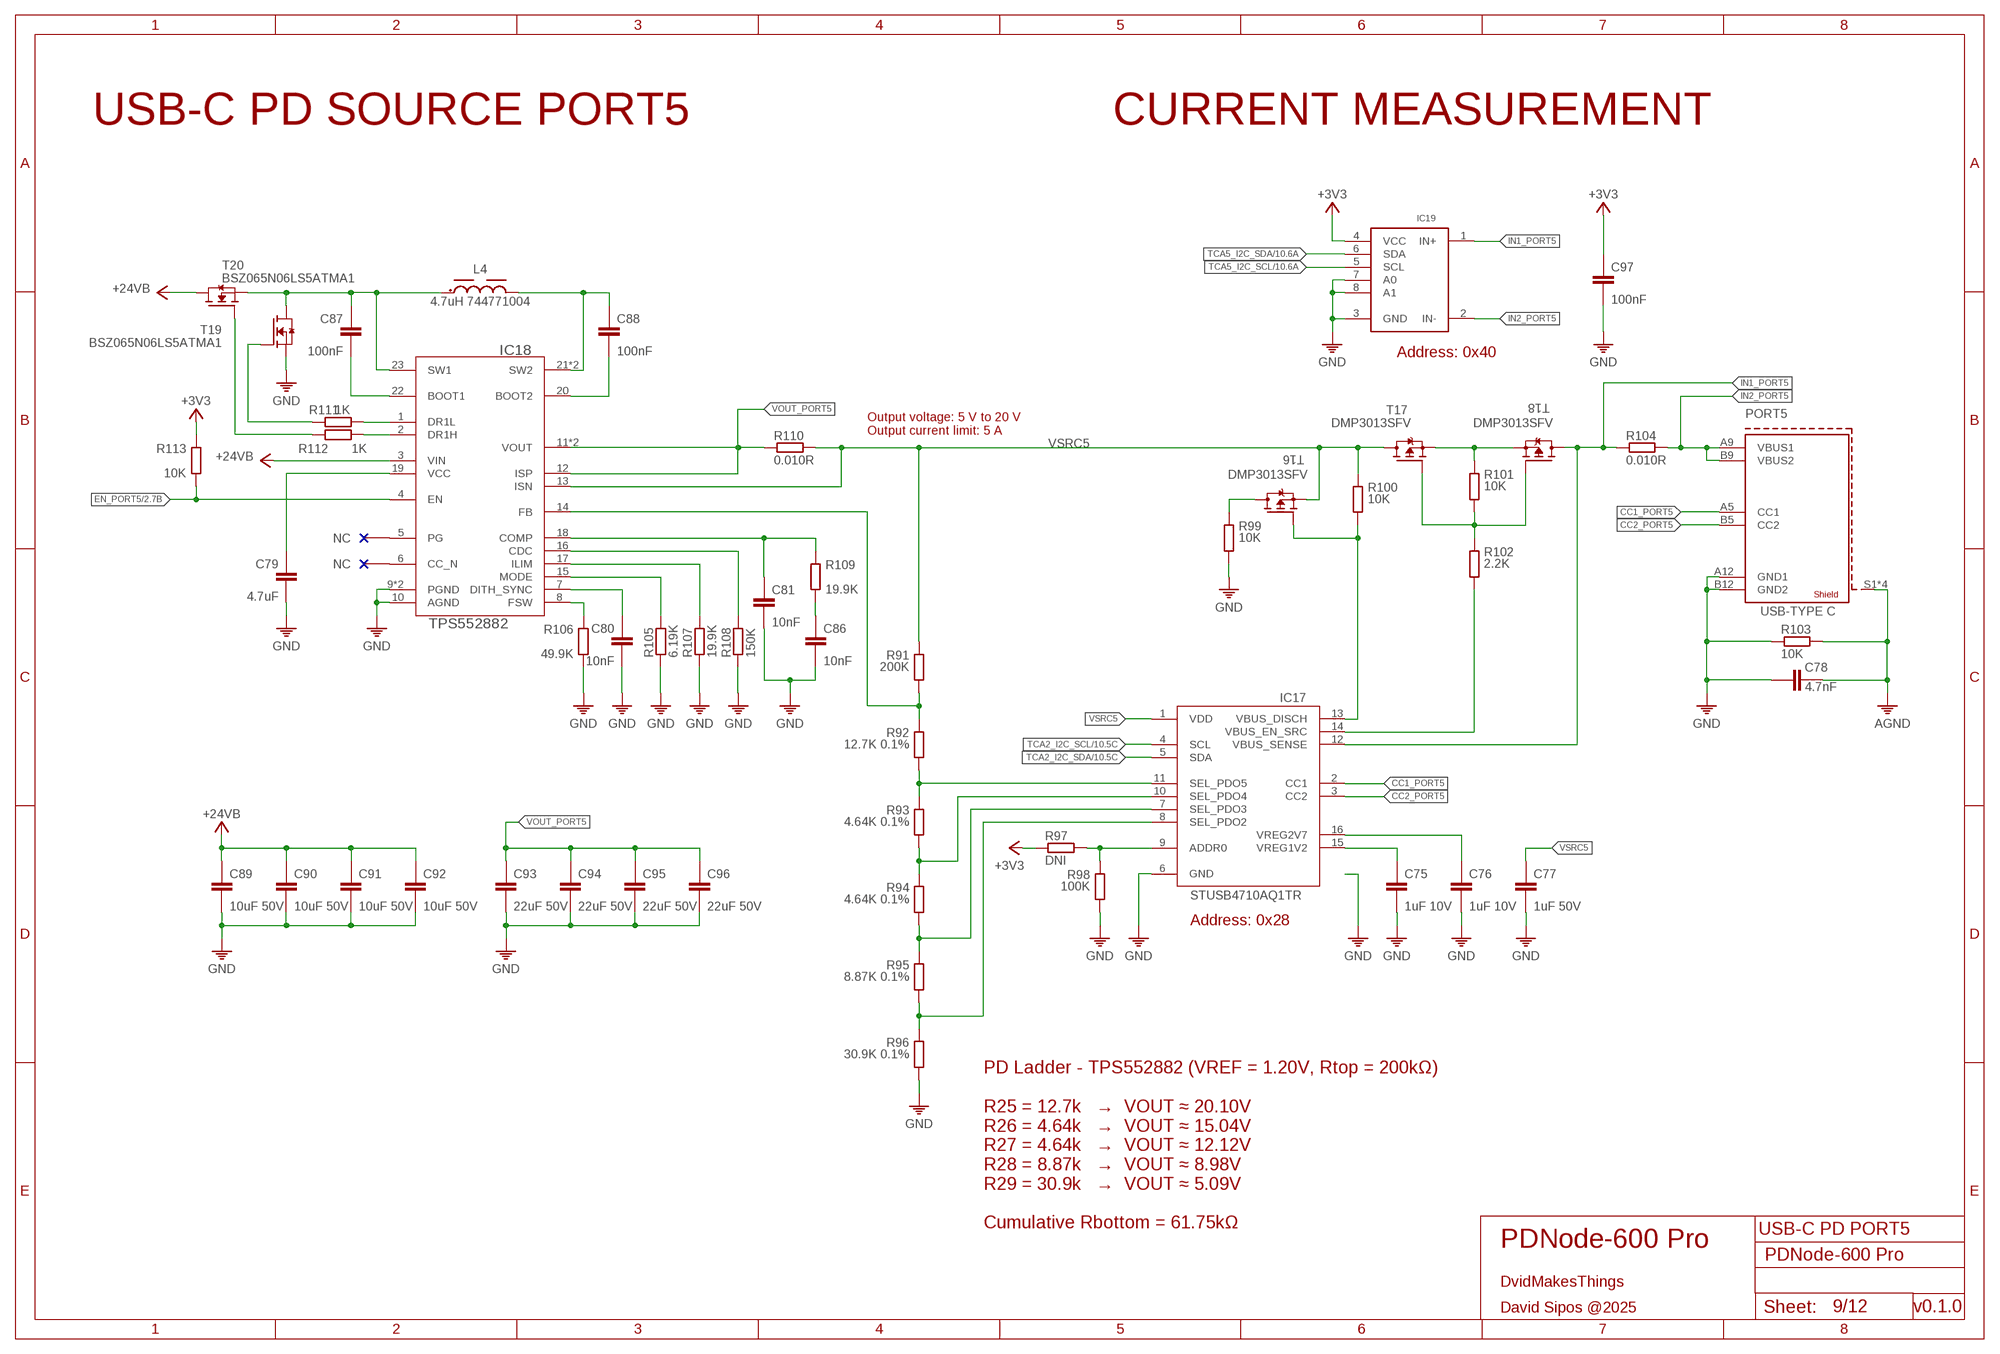
[diagram p8: schematic, sheet 9]

### Parts
C75  1uF 10V  C-0201  [0201]
C76  1uF 10V  C-0201  [0201]
C77  1uF 50V  C-0603  [C0603]
C78  4.7nF  C-0402  [C0402]
C79  4.7uF  C-0402  [C0402]
C80  10nF  C-0201  [0201]
C81  10nF  C-0201  [0201]
C86  10nF  C-0201  [0201]
C87  100nF  C-0402  [C0402]
C88  100nF  C-0402  [C0402]
C89  10uF 50V  C-0805  [C0805]
C90  10uF 50V  C-0805  [C0805]
C91  10uF 50V  C-0805  [C0805]
C92  10uF 50V  C-0805  [C0805]
C93  22uF 50V  C-0805  [C0805]
C94  22uF 50V  C-0805  [C0805]
C95  22uF 50V  C-0805  [C0805]
C96  22uF 50V  C-0805  [C0805]
C97  100nF  C-0201  [0201]
IC17  STUSB4710AQ1TR  [QFN50P300X300X55-16N]
IC18  TPS552882  [RPM0026A-MFG]
IC19  INA219BIDCNT  [SOT23-8]
L4  4.7uH 744771004  WE-PD_1280_74477004  [WE-PD_1280]
PORT5  632722100213  [632722100213]
R91  200K  R0201  [R0201]
R92  12.7K 0.1%  R0201  [R0201]
R93  4.64K 0.1%  R0201  [R0201]
R94  4.64K 0.1%  R0201  [R0201]
R95  8.87K 0.1%  R0201  [R0201]
R96  30.9K 0.1%  R0201  [R0201]
R97  DNI  R0201  [R0201]
R98  100K  R0201  [R0201]
R99  10K  R0402  [0402]
R100  10K  R0402  [0402]
R101  10K  R0201  [R0201]
R102  2.2K  R0201  [R0201]
R103  10K  R0402  [0402]
R104  0.010R  R2512  [2512]
R105  6.19K  R0201  [R0201]
R106  49.9K  R0201  [R0201]
R107  19.9K  R0201  [R0201]
R108  150K  R0201  [R0201]
R109  19.9K  R0201  [R0201]
R110  0.010R  R2512  [2512]
R111  1K  R0201  [R0201]
R112  1K  R0201  [R0201]
R113  10K  R0201  [R0201]
T16  DMP3013SFV  DMP3013SFV-7UX  [POWERDI3333-8_UX_DIO-L]
T17  DMP3013SFV  DMP3013SFV-7UX  [POWERDI3333-8_UX_DIO-L]
T18  DMP3013SFV  DMP3013SFV-7UX  [POWERDI3333-8_UX_DIO-L]
T19  BSZ065N06LS5ATMA1  IPZ40N04S5L7R4ATMA1  [POWERDI3333-8_UX_DIO-L]
T20  BSZ065N06LS5ATMA1  IPZ40N04S5L7R4ATMA1  [POWERDI3333-8_UX_DIO-L]

### Nets
+3V3: C97.1 IC19.4(VCC) R97.1 R113.1 ; also sheet 1,2,3,4,5,6,7,8,10,11,12
+24V_B: C89.1 C90.1 C91.1 C92.1 IC18.3(VIN) T20.5(D) T20.6(D) T20.7(D) T20.8(D) T20.9(D) ; supply symbol labelled +24VB ; also sheet 3,10,11,12
AGND: C78.2 PORT5.S1(SHIELD1) PORT5.S2(SHIELD1) PORT5.S3(SHIELD1) PORT5.S4(SHIELD1) R103.2 ; also sheet 1,2,4,5,6,7,8,10,11,12
CC1_PORT5: IC17.2(CC1) PORT5.A5(CC1)
CC2_PORT5: IC17.3(CC2) PORT5.B5(CC2)
EN_PORT5: IC18.4(EN) R113.2 ; also sheet 2
GND: C75.2 C76.2 C77.2 C78.1 C79.2 C80.2 C81.2 C86.2 C89.2 C90.2 C91.2 C92.2 C93.2 C94.2 C95.2 C96.2 C97.2 IC17.6(GND) IC18.9(PGND) IC18.10(AGND) IC18.24(PGND) IC19.3(GND) IC19.7(A0) IC19.8(A1) PORT5.A12(GND1) PORT5.B12(GND2) R96.2 R98.2 R99.2 R103.1 R105.2 R106.2 R107.2 R108.2 T19.1(S) T19.2(S) T19.3(S) ; also sheet 1,2,3,4,5,6,7,8,10,11,12
IN1_PORT5: IC17.12(VBUS_SENSE) IC19.1(IN+) R104.1 T18.5(D) T18.6(D) T18.7(D) T18.8(D) T18.9(D)
IN2_PORT5: IC19.2(IN-) PORT5.A9(VBUS1) PORT5.B9(VBUS2) R104.2
N$105: IC18.14(FB) R91.2 R92.1
N$106: IC17.11(SEL_PDO5) R92.2 R93.1
N$107: IC17.10(SEL_PDO4) R93.2 R94.1
N$108: IC17.7(SEL_PDO3) R94.2 R95.1
N$109: IC17.8(SEL_PDO2) R95.2 R96.1
N$110: C75.1 IC17.15(VREG1V2)
N$111: C76.1 IC17.16(VREG2V7)
N$112: IC17.9(ADDR0) R97.2 R98.1
N$113: R99.1 T16.5(D) T16.6(D) T16.7(D) T16.8(D) T16.9(D)
N$114: IC17.13(VBUS_DISCH) R100.2 T16.4(G)
N$115: R101.1 T17.1(S) T17.2(S) T17.3(S) T18.1(S) T18.2(S) T18.3(S)
N$116: R101.2 R102.1 T17.4(G) T18.4(G)
N$117: IC17.14(VBUS_EN_SRC) R102.2
N$118: C86.1 R109.2
N$119: IC18.8(FSW) R106.1
N$120: C80.1 IC18.7(DITH_SYNC)
N$121: IC18.15(MODE) R105.1
N$122: IC18.17(ILIM) R107.1
N$123: IC18.16(CDC) R108.1
N$124: C81.1 IC18.18(COMP) R109.1
N$125: C79.1 IC18.19(VCC)
N$126: C87.1 IC18.23(SW1) L4.1 T19.5(D) T19.6(D) T19.7(D) T19.8(D) T19.9(D) T20.1(S) T20.2(S) T20.3(S)
N$127: C88.1 IC18.21(SW2) IC18.25(SW2) L4.2
N$128: C87.2 IC18.22(BOOT1)
N$129: C88.2 IC18.20(BOOT2)
N$130: R112.2 T20.4(G)
N$131: R111.2 T19.4(G)
N$132: IC18.1(DR1L) R111.1
N$133: IC18.2(DR1H) R112.1
TCA2_I2C_SCL: IC17.4(SCL) ; also sheet 2,10
TCA2_I2C_SDA: IC17.5(SDA) ; also sheet 2,10
TCA5_I2C_SCL: IC19.5(SCL) ; also sheet 2,10,11,12
TCA5_I2C_SDA: IC19.6(SDA) ; also sheet 2,10,11,12
VOUT_PORT5: C93.1 C94.1 C95.1 C96.1 IC18.11(VOUT) IC18.12(ISP) IC18.26(VOUT) R110.1
VSRC5: C77.1 IC17.1(VDD) IC18.13(ISN) R91.1 R100.1 R110.2 T16.1(S) T16.2(S) T16.3(S) T17.5(D) T17.6(D) T17.7(D) T17.8(D) T17.9(D)
Unconnected: IC18.5(PG) IC18.6(CC_N)

### Notes on the sheet
- USB-C PD SOURCE PORT5 | CURRENT MEASUREMENT
- Address: 0x40
- Output voltage: 5 V to 20 V
  Output current limit: 5 A
- Address: 0x28
- USB-C PD PORT5
- PD Ladder - TPS552882 (VREF = 1.20V, Rtop = 200kΩ)
  
  R25 = 12.7k   →  VOUT ≈ 20.10V
  R26 = 4.64k   →  VOUT ≈ 15.04V
  R27 = 4.64k   →  VOUT ≈ 12.12V
  R28 = 8.87k   →  VOUT ≈ 8.98V
  R29 = 30.9k   →  VOUT ≈ 5.09V
  
  Cumulative Rbottom = 61.75kΩ
- PDNode-600 Pro
- DvidMakesThings
- David Sipos @2025 | v0.1.0